# Altium project cpu mais pipoca D.PrjPcb
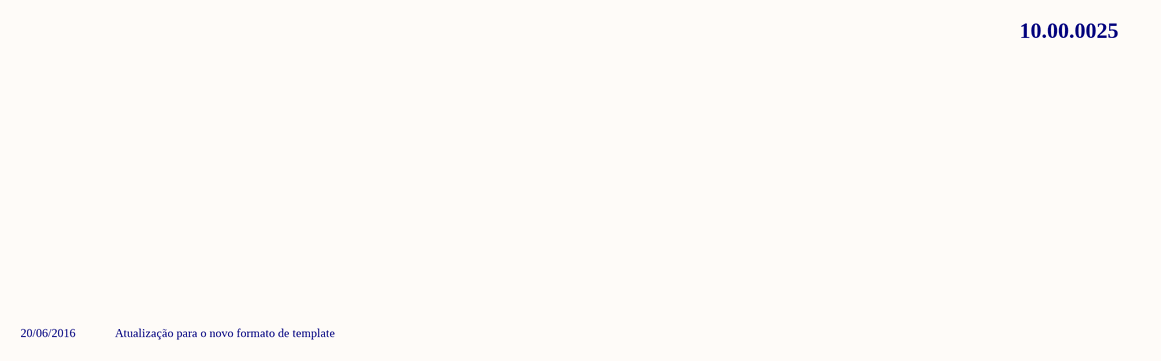
[diagram p0: Capa.SchDoc]
16 sheets, 247 parts. Net scope: global (net labels, ports and power ports of the same name join across sheets).
Board file: PIPOCPUD_2006.PCBDOC
Sheets:
  Capa.SchDoc
  amplificadorAudio.SchDoc
  ControleLeds.SchDoc
  ControlePotencia.SchDoc
  CPU.SchDoc
  EntradaSensores.SchDoc
  EntradaSensorTemperatura.SchDoc
  IHM.SchDoc
  InterfaceConfiguracao.SchDoc
  InterfaceGSM.SchDoc
  InterfacePagamentos.SchDoc
  JTAG.SchDoc
  Memoria.SchDoc
  ModuloCelular.SchDoc
  Regulador.SchDoc
  SaidasMotoresCC.SchDoc

## Sheet Capa.SchDoc: CONTROLADORA MAIS PIPOCA REV. D
size A3; Author: Marcos Aquino; DocumentNumber: 1; SheetNumber: 1; SheetTotal: 16

### Notes on the sheet
- 10.00.0025
- 20/06/2016
- Atualização para o novo formato de template
- Código
- Quark Tecnologia Eletrônica Ltda.
- Rua 216, nº 238 - Sala 01 - Meia Praia - Itapema/SC
- Observações
- (47) 3246-6352  -
- www.quarktee.com.br
- contato@quarktee.com.br
- Projeto
- Quantidade de Páginas
- Revisão
- Projetista
- Local arquivos no servidor
- Data
- Modificação
- Solicitador por:
- Executador por:
- Aprovado por:

## Sheet amplificadorAudio.SchDoc: CONTROLADORA AIRPOPCORN
size A3; DocumentNumber: 10.00.0025; SheetNumber: 2; SheetTotal: 16
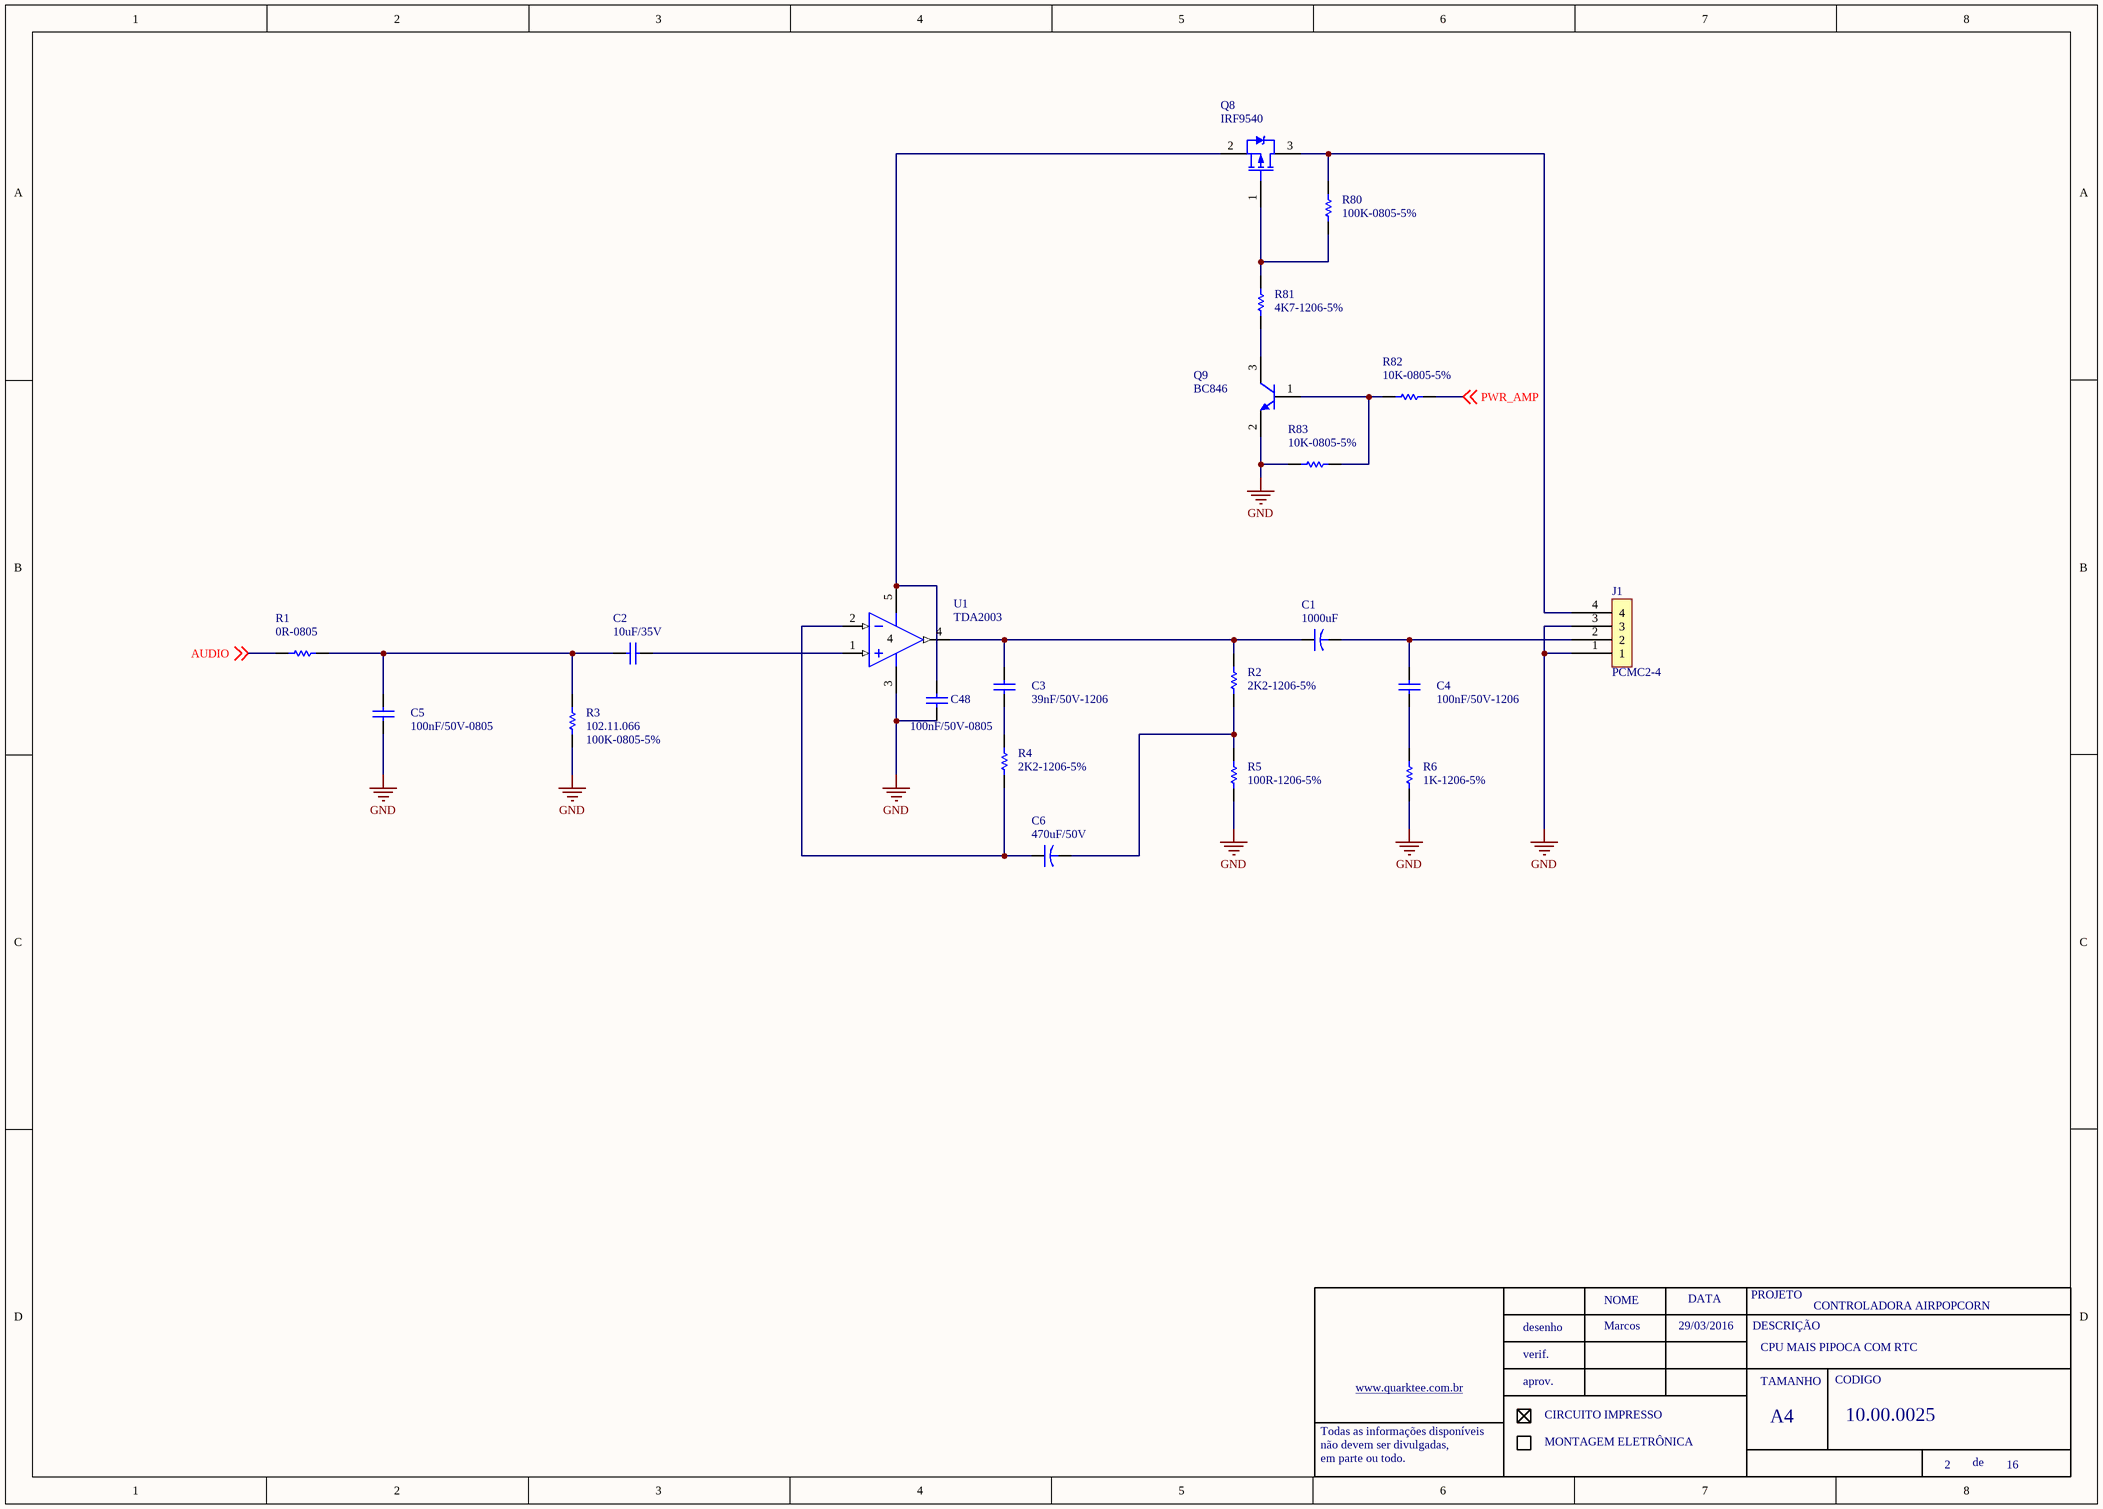
[diagram p1: amplificadorAudio.SchDoc]

### Parts
C1  1000uF  [CAP 10X5]
C2  10uF/35V  [CAP POL 5x11mm]
C3  39nF/50V-1206  [1206-REVISADO O]
C4  100nF/50V-1206  [1206-REVISADO O]
C5  100nF/50V-0805  [0805-REVISADO O]
C6  470uF/50V  [CAP 10X5]
C48  100nF/50V-0805  [0805-REVISADO O]
J1  PCMC2-4  [PCMC2-4]
Q8  IRF9540  [TO220-3 EM PÉ]
Q9  BC846  [SOT23 - REVISAD]
R1  0R-0805  [0805-REVISADO O]
R2  2K2-1206-5%  [1206-REVISADO O]
R3  100K-0805-5%  ERP: 102.11.066  [0805-REVISADO O]
R4  2K2-1206-5%  [1206-REVISADO O]
R5  100R-1206-5%  [1206-REVISADO O]
R6  1K-1206-5%  [1206-REVISADO O]
R80  100K-0805-5%  [0805-REVISADO O]
R81  4K7-1206-5%  [1206-REVISADO O]
R82  10K-0805-5%  [0805-REVISADO O]
R83  10K-0805-5%  [0805-REVISADO O]
U1  TDA2003  [PENTAWATT V]

### Nets
GND: C5.1 C48.1 J1.1 J1.3 Q9.2(E) R3.1 R5.2 R6.2 R83.1 U1.3(GND)
AUDIO: R1.1 ; off-sheet AUDIO
PWR_AMP: R82.2 ; off-sheet PWR_AMP
NetC1_1: C1.1 C3.2 R2.1 U1.4(OUT)
NetC1_2: C1.2 C4.2 J1.2
NetC2_1: C2.1 C5.2 R1.2 R3.2
NetC2_2: C2.2 U1.1(IN+)
NetC3_1: C3.1 R4.1
NetC4_1: C4.1 R6.1
NetC6_1: C6.1 R4.2 U1.2(IN-)
NetC6_2: C6.2 R2.2 R5.1
NetC48_2: C48.2 Q8.2(DRENO) U1.5(V+)
NetJ1_4: J1.4 Q8.3(SOURCE) R80.2
NetQ8_1: Q8.1(GATE) R80.1 R81.2
NetQ9_1: Q9.1(B) R82.1 R83.2
NetQ9_3: Q9.3(C) R81.1

### Notes on the sheet
- Marcos
- 29/03/2016
- CPU MAIS PIPOCA COM RTC
- NOME
- DATA
- PROJETO
- DESCRIÇÃO
- www.quarktee.com.br
- desenho
- verif.
- aprov.
- TAMANHO
- CODIGO
- Todas as informações disponíveis
- não devem ser divulgadas,
- em parte ou todo.
- CIRCUITO IMPRESSO
- MONTAGEM ELETRÔNICA
- A4
- de

### Library data of the parts
C1 = 470uF/50V: ERP: 105.01.005
C2 = 10uF/35V-tantalo-2413
C3-C5 C48 = 100nF/50-0805-NPO: ERP: 104.11.005
Q9 = BC846: BC846L; ERP: 106.22.001
R1 = 1K-0805-5%: ERP: 102.11.042
R2 R4-R6 = 390R-2512-5%: ERP: 102.31.002
R80 = RES 100K-0805: 100K-0805; ERP: 102.11.066
C6 = 470uF/50V: ERP: 105.01.005
R81 = 4K7-1206-5%: ERP: 102.12.050
R82 R83 = 10K-0805-5%: ERP: 102.11.054

## Sheet ControleLeds.SchDoc: CONTROLADORA AIRPOPCORN
size A3; DocumentNumber: 10.00.0025; SheetNumber: 3; SheetTotal: 16
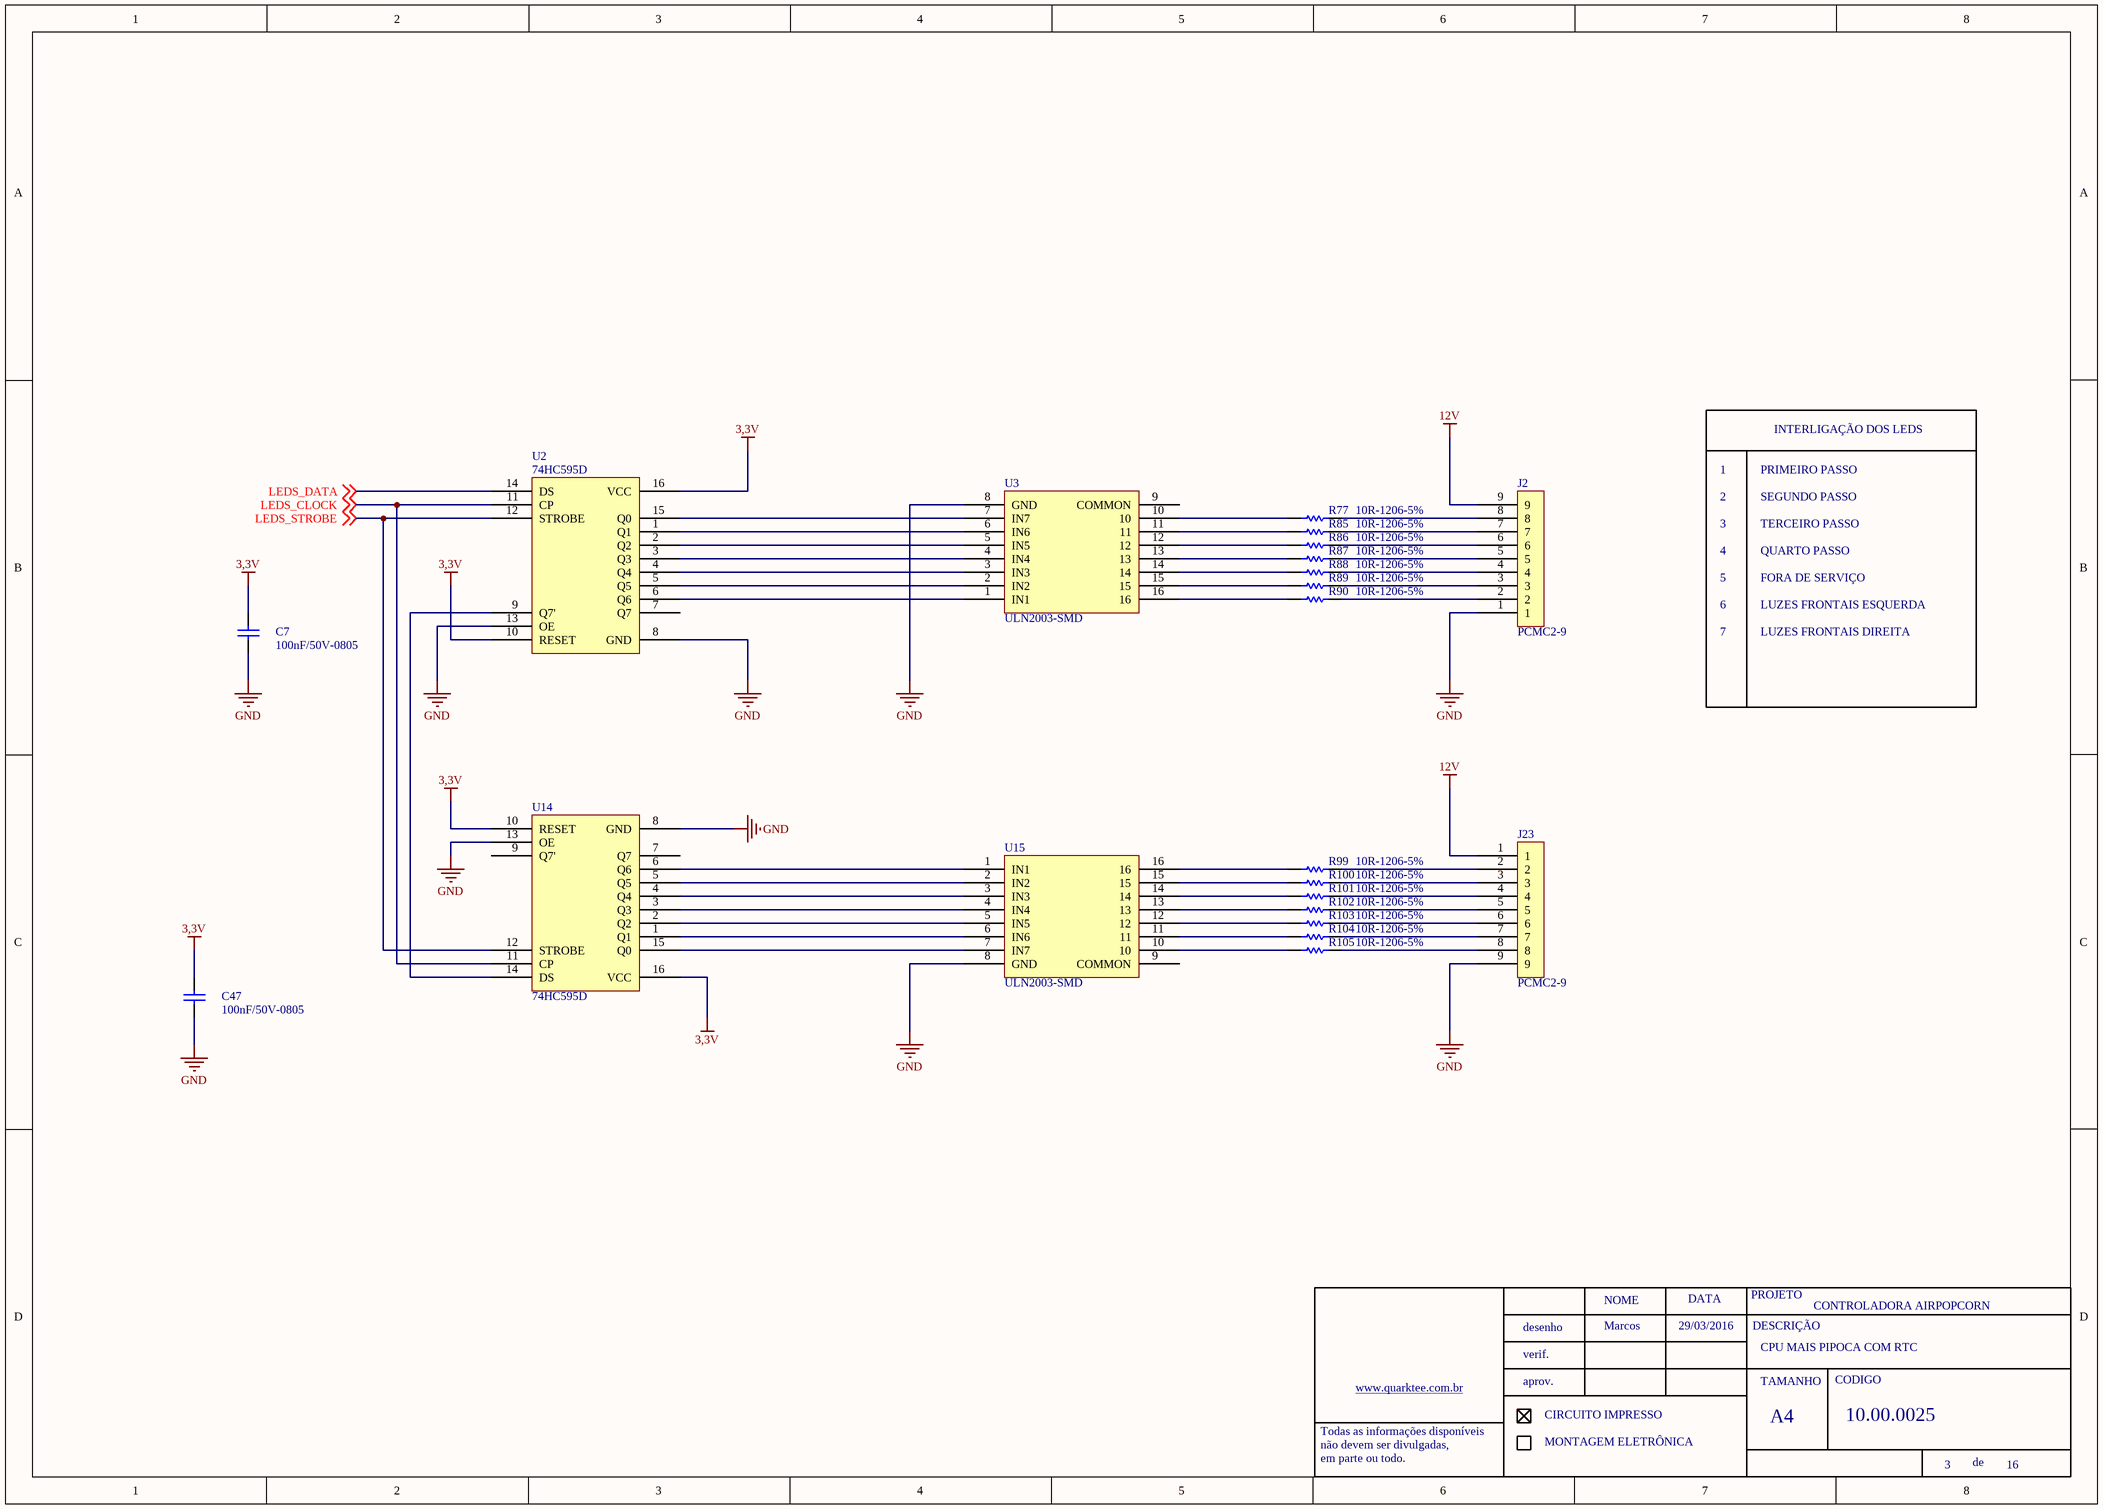
[diagram p2: ControleLeds.SchDoc]

### Parts
C7  100nF/50V-0805  [0805-REVISADO O]
C47  100nF/50V-0805  [0805-REVISADO O]
J2  PCMC2-9  [PCMC2-9]
J23  PCMC2-9  [PCMC2-9]
R77  10R-1206-5%  [1206-REVISADO O]
R85  10R-1206-5%  [1206-REVISADO O]
R86  10R-1206-5%  [1206-REVISADO O]
R87  10R-1206-5%  [1206-REVISADO O]
R88  10R-1206-5%  [1206-REVISADO O]
R89  10R-1206-5%  [1206-REVISADO O]
R90  10R-1206-5%  [1206-REVISADO O]
R99  10R-1206-5%  [1206-REVISADO O]
R100  10R-1206-5%  [1206-REVISADO O]
R101  10R-1206-5%  [1206-REVISADO O]
R102  10R-1206-5%  [1206-REVISADO O]
R103  10R-1206-5%  [1206-REVISADO O]
R104  10R-1206-5%  [1206-REVISADO O]
R105  10R-1206-5%  [1206-REVISADO O]
U2  74HC595D  [SOIC 16 PINOS]
U3  ULN2003-SMD  [SOIC 16 PINOS]
U14  74HC595D  [SOIC 16 PINOS]
U15  ULN2003-SMD  [SOIC 16 PINOS]

### Nets
3,3V: C7.2 C47.2 U2.10(RESET) U2.16(VCC) U14.10(RESET) U14.16(VCC)
12V: J2.9 J23.1
GND: C7.1 C47.1 J2.1 J23.9 U2.8(GND) U2.13(OE) U3.8(GND) U14.8(GND) U14.13(OE) U15.8(GND)
LEDS_CLOCK: U2.11(CP) U14.11(CP) ; off-sheet LEDS_CLOCK
LEDS_DATA: U2.14(DS) ; off-sheet LEDS_DATA
LEDS_STROBE: U2.12(STROBE) U14.12(STROBE) ; off-sheet LEDS_STROBE
NetJ2_2: J2.2 R90.2
NetJ2_3: J2.3 R89.2
NetJ2_4: J2.4 R88.2
NetJ2_5: J2.5 R87.2
NetJ2_6: J2.6 R86.2
NetJ2_7: J2.7 R85.2
NetJ2_8: J2.8 R77.2
NetJ23_2: J23.2 R99.2
NetJ23_3: J23.3 R100.2
NetJ23_4: J23.4 R101.2
NetJ23_5: J23.5 R102.2
NetJ23_6: J23.6 R103.2
NetJ23_7: J23.7 R104.2
NetJ23_8: J23.8 R105.2
NetR77_1: R77.1 U3.10
NetR85_1: R85.1 U3.11
NetR86_1: R86.1 U3.12
NetR87_1: R87.1 U3.13
NetR88_1: R88.1 U3.14
NetR89_1: R89.1 U3.15
NetR90_1: R90.1 U3.16
NetR99_1: R99.1 U15.16
NetR100_1: R100.1 U15.15
NetR101_1: R101.1 U15.14
NetR102_1: R102.1 U15.13
NetR103_1: R103.1 U15.12
NetR104_1: R104.1 U15.11
NetR105_1: R105.1 U15.10
NetU2_1: U2.1(Q1) U3.6(IN6)
NetU2_2: U2.2(Q2) U3.5(IN5)
NetU2_3: U2.3(Q3) U3.4(IN4)
NetU2_4: U2.4(Q4) U3.3(IN3)
NetU2_5: U2.5(Q5) U3.2(IN2)
NetU2_6: U2.6(Q6) U3.1(IN1)
NetU2_9: U2.9(Q7') U14.14(DS)
NetU2_15: U2.15(Q0) U3.7(IN7)
NetU14_1: U14.1(Q1) U15.6(IN6)
NetU14_2: U14.2(Q2) U15.5(IN5)
NetU14_3: U14.3(Q3) U15.4(IN4)
NetU14_4: U14.4(Q4) U15.3(IN3)
NetU14_5: U14.5(Q5) U15.2(IN2)
NetU14_6: U14.6(Q6) U15.1(IN1)
NetU14_15: U14.15(Q0) U15.7(IN7)

Not connected (* = marked no-connect by the designer): U2 7(Q7); U3 9(COMMON); U14 7(Q7) 9(Q7'); U15 9(COMMON)

### Notes on the sheet
- INTERLIGAÇÃO DOS LEDS
- 1
- 2
- PRIMEIRO PASSO
- SEGUNDO PASSO
- 3
- 4
- 5
- TERCEIRO PASSO
- QUARTO PASSO
- FORA DE SERVIÇO
- 6
- 7
- LUZES FRONTAIS ESQUERDA
- LUZES FRONTAIS DIREITA
- Marcos
- 29/03/2016
- CPU MAIS PIPOCA COM RTC
- NOME
- DATA
- PROJETO
- DESCRIÇÃO
- www.quarktee.com.br
- desenho
- verif.
- aprov.
- TAMANHO
- CODIGO
- Todas as informações disponíveis
- não devem ser divulgadas,
- em parte ou todo.
- CIRCUITO IMPRESSO
- MONTAGEM ELETRÔNICA
- A4
- de

### Library data of the parts
C7 C47 = 100nF/50-0805-NPO: ERP: 104.11.005
R77 R85-R90 R99-R105 = 10R-0805-5%
U2 U14 = 74HC595D: ERP: CADASTRAR
U3 U15 = ULN2003

## Sheet ControlePotencia.SchDoc: CONTROLADORA AIRPOPCORN
size A3; DocumentNumber: 10.00.0025; SheetNumber: 4; SheetTotal: 16
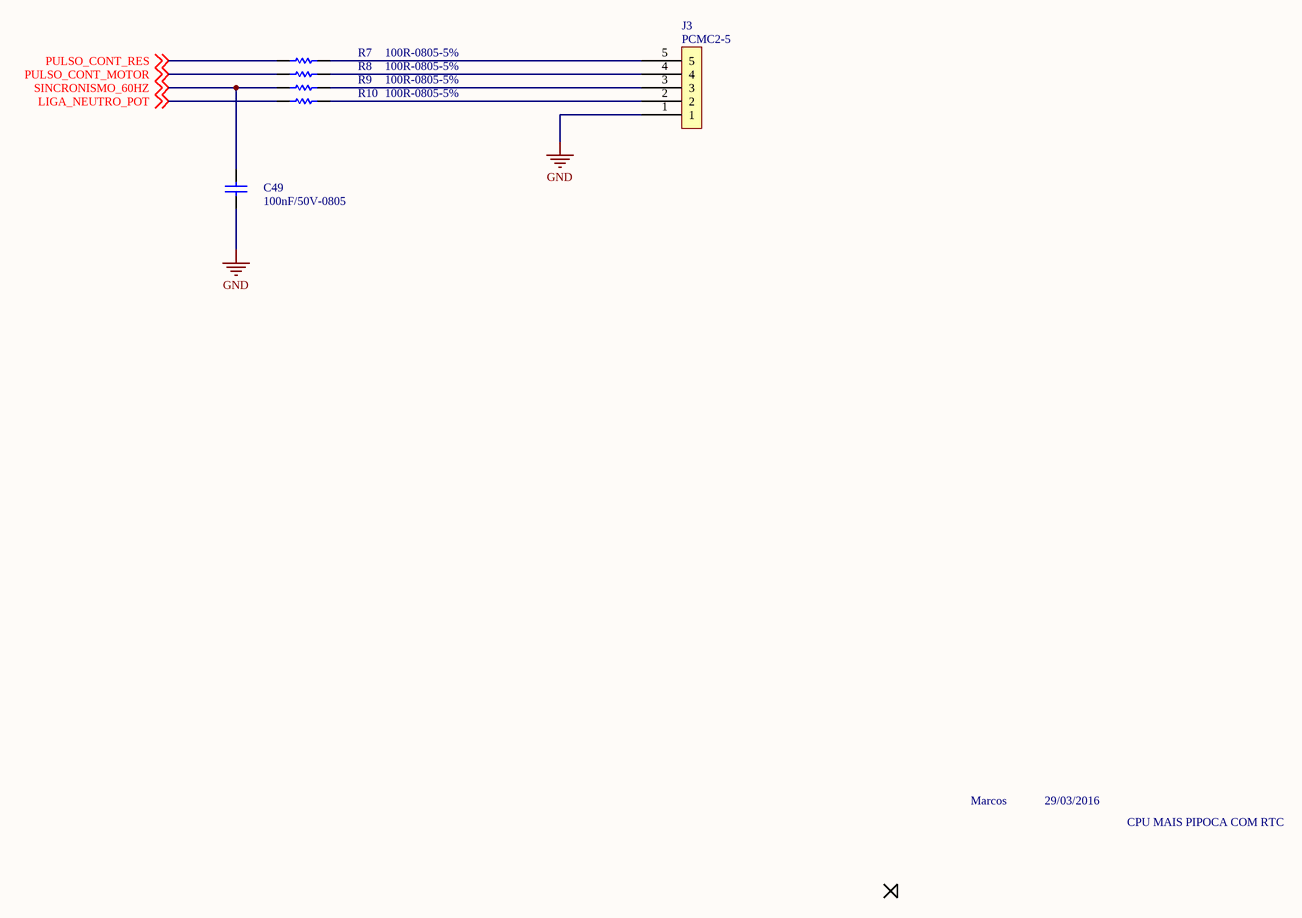
[diagram p3: ControlePotencia.SchDoc]

### Parts
C49  100nF/50V-0805
J3  PCMC2-5  [PCMC2-5]
R7  100R-0805-5%  [0805-REVISADO O]
R8  100R-0805-5%  [0805-REVISADO O]
R9  100R-0805-5%  [0805-REVISADO O]
R10  100R-0805-5%  [0805-REVISADO O]

### Nets
GND: C49.1 J3.1
LIGA_NEUTRO_POT: R10.1 ; off-sheet LIGA_NEUTRO_POT
PULSO_CONT_MOTOR: R8.1 ; off-sheet PULSO_CONT_MOTOR
PULSO_CONT_RES: R7.1 ; off-sheet PULSO_CONT_RES
SINCRONISMO_60HZ: C49.2 R9.1 ; off-sheet SINCRONISMO_60HZ
NetJ3_2: J3.2 R10.2
NetJ3_3: J3.3 R9.2
NetJ3_4: J3.4 R8.2
NetJ3_5: J3.5 R7.2

### Notes on the sheet
- Marcos
- 29/03/2016
- CPU MAIS PIPOCA COM RTC
- NOME
- DATA
- PROJETO
- DESCRIÇÃO
- www.quarktee.com.br
- desenho
- verif.
- aprov.
- TAMANHO
- CODIGO
- Todas as informações disponíveis
- não devem ser divulgadas,
- em parte ou todo.
- CIRCUITO IMPRESSO
- MONTAGEM ELETRÔNICA
- A4
- de

### Library data of the parts
C49 = 100nF/50-0805-NPO: ERP: 104.11.005
R7-R10 = 100R-0805-5%: ERP: 102.11.031

## Sheet CPU.SchDoc: CONTROLADORA AIRPOPCORN
size A3; DocumentNumber: 10.00.0025; SheetNumber: 5; SheetTotal: 16
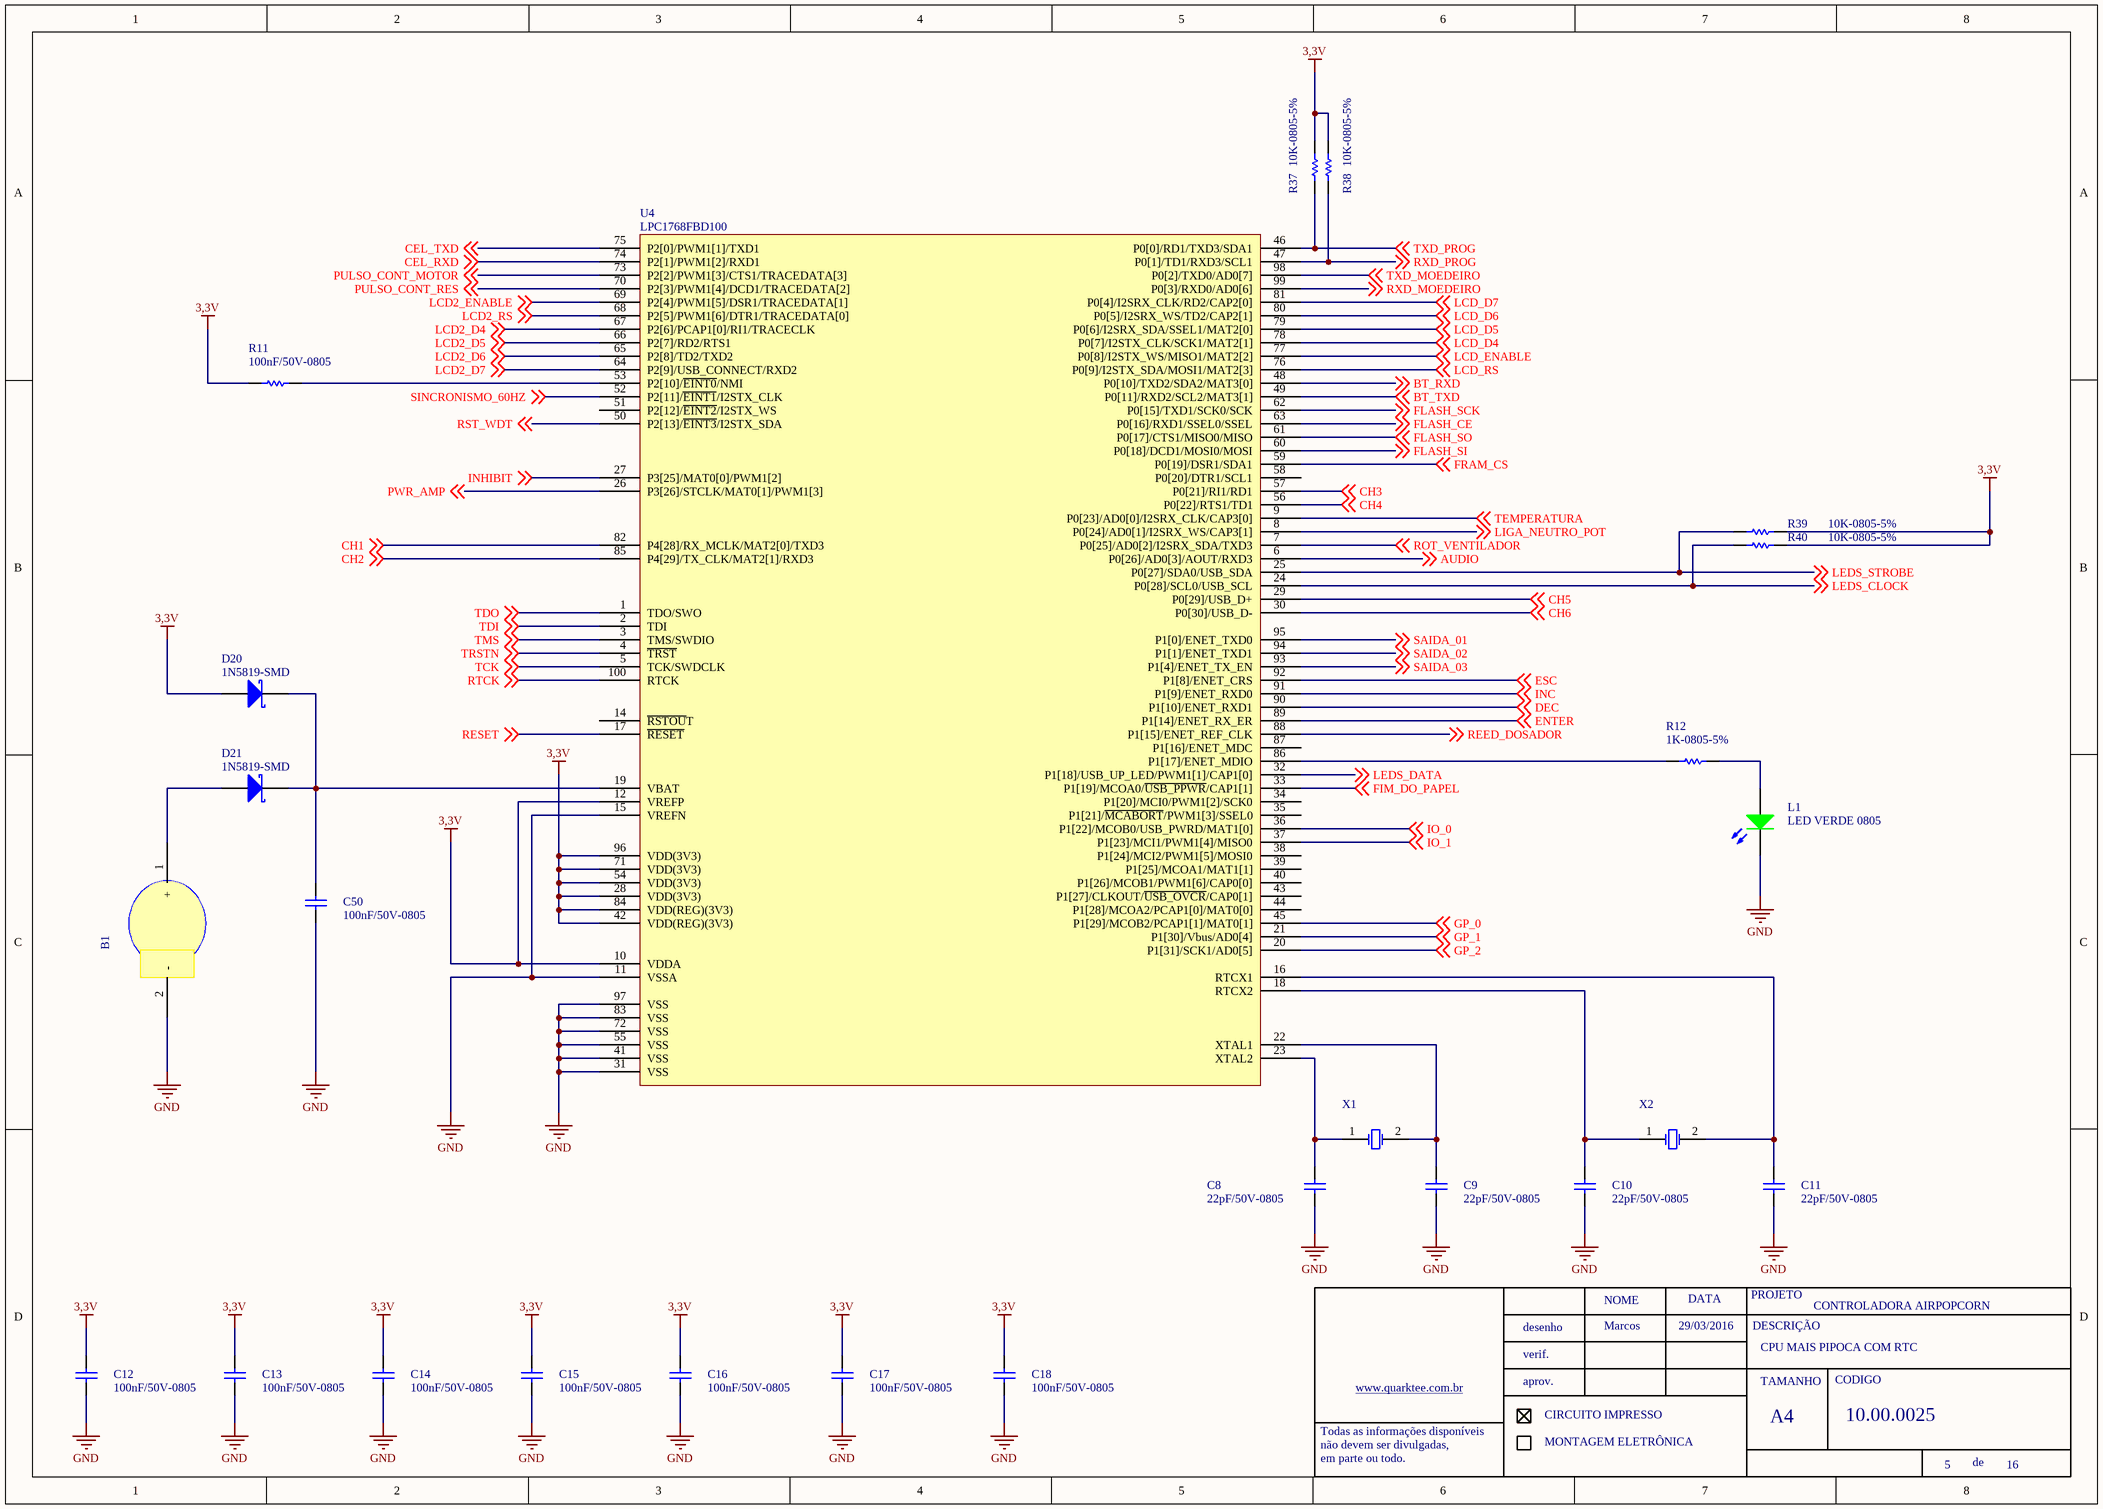
[diagram p4: CPU.SchDoc]

### Parts
B1  (no value)
C8  22pF/50V-0805  [0805-REVISADO O]
C9  22pF/50V-0805  [0805-REVISADO O]
C10  22pF/50V-0805  [0805-REVISADO O]
C11  22pF/50V-0805  [0805-REVISADO O]
C12  100nF/50V-0805  [0805-REVISADO O]
C13  100nF/50V-0805  [0805-REVISADO O]
C14  100nF/50V-0805  [0805-REVISADO O]
C15  100nF/50V-0805  [0805-REVISADO O]
C16  100nF/50V-0805  [0805-REVISADO O]
C17  100nF/50V-0805  [0805-REVISADO O]
C18  100nF/50V-0805  [0805-REVISADO O]
C50  100nF/50V-0805  [0805-REVISADO O]
D20  1N5819-SMD
D21  1N5819-SMD
L1  LED VERDE 0805  [LED 0805 - REVI]
R11  100nF/50V-0805  [0805-REVISADO O]
R12  1K-0805-5%  [0805-REVISADO O]
R37  10K-0805-5%  [0805-REVISADO O]
R38  10K-0805-5%  [0805-REVISADO O]
R39  10K-0805-5%  [0805-REVISADO O]
R40  10K-0805-5%  [0805-REVISADO O]
U4  LPC1768FBD100  [LQFP-100 pasta]
X1  (no value)  [XTALV']
X2  (no value)  [XTAL_32768']

### Nets
3,3V: C12.2 C13.2 C14.2 C15.2 C16.2 C17.2 C18.2 D20.1(A) R11.1 R37.2 R38.2 R39.2 R40.2 U4.10(VDDA) U4.12(VREFP) U4.28(VDD(3V3)) U4.42(VDD(REG)(3V3)) U4.54(VDD(3V3)) U4.71(VDD(3V3)) U4.84(VDD(REG)(3V3)) U4.96(VDD(3V3))
GND: B1.2(-) C8.1 C9.1 C10.1 C11.1 C12.1 C13.1 C14.1 C15.1 C16.1 C17.1 C18.1 C50.1 L1.2(K) U4.11(VSSA) U4.15(VREFN) U4.31(VSS) U4.41(VSS) U4.55(VSS) U4.72(VSS) U4.83(VSS) U4.97(VSS)
AUDIO: U4.6(P0[26]/AD0[3]/AOUT/RXD3) ; off-sheet AUDIO
BT_RXD: U4.48(P0[10]/TXD2/SDA2/MAT3[0]) ; off-sheet BT_RXD
BT_TXD: U4.49(P0[11]/RXD2/SCL2/MAT3[1]) ; off-sheet BT_TXD
CEL_RXD: U4.74(P2[1]/PWM1[2]/RXD1) ; off-sheet CEL_RXD
CEL_TXD: U4.75(P2[0]/PWM1[1]/TXD1) ; off-sheet CEL_TXD
CH1: U4.82(P4[28]/RX_MCLK/MAT2[0]/TXD3) ; off-sheet CH1
CH2: U4.85(P4[29]/TX_CLK/MAT2[1]/RXD3) ; off-sheet CH2
CH3: U4.57(P0[21]/RI1/RD1) ; off-sheet CH3
CH4: U4.56(P0[22]/RTS1/TD1) ; off-sheet CH4
CH5: U4.29(P0[29]/USB_D+) ; off-sheet CH5
CH6: U4.30(P0[30]/USB_D-) ; off-sheet CH6
DEC: U4.90(P1[10]/ENET_RXD1) ; off-sheet DEC
ENTER: U4.89(P1[14]/ENET_RX_ER) ; off-sheet ENTER
ESC: U4.92(P1[8]/ENET_CRS) ; off-sheet ESC
FIM_DO_PAPEL: U4.33(P1[19]/MCOA0/~{USB_PPWR}/CAP1[1]) ; off-sheet FIM_DO_PAPEL
FLASH_CE: U4.63(P0[16]/RXD1/SSEL0/SSEL) ; off-sheet FLASH_CE
FLASH_SCK: U4.62(P0[15]/TXD1/SCK0/SCK) ; off-sheet FLASH_SCK
FLASH_SI: U4.60(P0[18]/DCD1/MOSI0/MOSI) ; off-sheet FLASH_SI
FLASH_SO: U4.61(P0[17]/CTS1/MISO0/MISO) ; off-sheet FLASH_SO
FRAM_CS: U4.59(P0[19]/DSR1/SDA1) ; off-sheet FRAM_CS
GP_0: U4.45(P1[29]/MCOB2/PCAP1[1]/MAT0[1]) ; off-sheet GP_0
GP_1: U4.21(P1[30]/Vbus/AD0[4]) ; off-sheet GP_1
GP_2: U4.20(P1[31]/SCK1/AD0[5]) ; off-sheet GP_2
INC: U4.91(P1[9]/ENET_RXD0) ; off-sheet INC
INHIBIT: U4.27(P3[25]/MAT0[0]/PWM1[2]) ; off-sheet INHIBIT
IO_0: U4.36(P1[22]/MCOB0/USB_PWRD/MAT1[0]) ; off-sheet IO_0
IO_1: U4.37(P1[23]/MCI1/PWM1[4]/MISO0) ; off-sheet IO_1
LCD2_D4: U4.67(P2[6]/PCAP1[0]/RI1/TRACECLK) ; off-sheet LCD2_D4
LCD2_D5: U4.66(P2[7]/RD2/RTS1) ; off-sheet LCD2_D5
LCD2_D6: U4.65(P2[8]/TD2/TXD2) ; off-sheet LCD2_D6
LCD2_D7: U4.64(P2[9]/USB_CONNECT/RXD2) ; off-sheet LCD2_D7
LCD2_ENABLE: U4.69(P2[4]/PWM1[5]/DSR1/TRACEDATA[1]) ; off-sheet LCD2_ENABLE
LCD2_RS: U4.68(P2[5]/PWM1[6]/DTR1/TRACEDATA[0]) ; off-sheet LCD2_RS
LCD_D4: U4.78(P0[7]/I2STX_CLK/SCK1/MAT2[1]) ; off-sheet LCD_D4
LCD_D5: U4.79(P0[6]/I2SRX_SDA/SSEL1/MAT2[0]) ; off-sheet LCD_D5
LCD_D6: U4.80(P0[5]/I2SRX_WS/TD2/CAP2[1]) ; off-sheet LCD_D6
LCD_D7: U4.81(P0[4]/I2SRX_CLK/RD2/CAP2[0]) ; off-sheet LCD_D7
LCD_ENABLE: U4.77(P0[8]/I2STX_WS/MISO1/MAT2[2]) ; off-sheet LCD_ENABLE
LCD_RS: U4.76(P0[9]/I2STX_SDA/MOSI1/MAT2[3]) ; off-sheet LCD_RS
LEDS_CLOCK: R40.1 U4.24(P0[28]/SCL0/USB_SCL) ; off-sheet LEDS_CLOCK
LEDS_DATA: U4.32(P1[18]/USB_UP_LED/PWM1[1]/CAP1[0]) ; off-sheet LEDS_DATA
LEDS_STROBE: R39.1 U4.25(P0[27]/SDA0/USB_SDA) ; off-sheet LEDS_STROBE
LIGA_NEUTRO_POT: U4.8(P0[24]/AD0[1]/I2SRX_WS/CAP3[1]) ; off-sheet LIGA_NEUTRO_POT
PULSO_CONT_MOTOR: U4.73(P2[2]/PWM1[3]/CTS1/TRACEDATA[3]) ; off-sheet PULSO_CONT_MOTOR
PULSO_CONT_RES: U4.70(P2[3]/PWM1[4]/DCD1/TRACEDATA[2]) ; off-sheet PULSO_CONT_RES
PWR_AMP: U4.26(P3[26]/STCLK/MAT0[1]/PWM1[3]) ; off-sheet PWR_AMP
REED_DOSADOR: U4.88(P1[15]/ENET_REF_CLK) ; off-sheet REED_DOSADOR
RESET: U4.17(~{RESET}) ; off-sheet RESET
ROT_VENTILADOR: U4.7(P0[25]/AD0[2]/I2SRX_SDA/TXD3) ; off-sheet ROT_VENTILADOR
RST_WDT: U4.50(P2[13]/~{EINT3}/I2STX_SDA) ; off-sheet RST_WDT
RTCK: U4.100(RTCK) ; off-sheet RTCK
RXD_MOEDEIRO: U4.99(P0[3]/RXD0/AD0[6]) ; off-sheet RXD_MOEDEIRO
RXD_PROG: R38.1 U4.47(P0[1]/TD1/RXD3/SCL1) ; off-sheet RXD_PROG
SAIDA_01: U4.95(P1[0]/ENET_TXD0) ; off-sheet SAIDA_01
SAIDA_02: U4.94(P1[1]/ENET_TXD1) ; off-sheet SAIDA_02
SAIDA_03: U4.93(P1[4]/ENET_TX_EN) ; off-sheet SAIDA_03
SINCRONISMO_60HZ: U4.52(P2[11]/~{EINT1}/I2STX_CLK) ; off-sheet SINCRONISMO_60HZ
TCK: U4.5(TCK/SWDCLK) ; off-sheet TCK
TDI: U4.2(TDI) ; off-sheet TDI
TDO: U4.1(TDO/SWO) ; off-sheet TDO
TEMPERATURA: U4.9(P0[23]/AD0[0]/I2SRX_CLK/CAP3[0]) ; off-sheet TEMPERATURA
TMS: U4.3(TMS/SWDIO) ; off-sheet TMS
TRSTN: U4.4(~{TRST}) ; off-sheet TRSTN
TXD_MOEDEIRO: U4.98(P0[2]/TXD0/AD0[7]) ; off-sheet TXD_MOEDEIRO
TXD_PROG: R37.1 U4.46(P0[0]/RD1/TXD3/SDA1) ; off-sheet TXD_PROG
NetB1_1: B1.1(+) D21.1(A)
NetC8_2: C8.2 U4.23(XTAL2) X1.1(OSC1)
NetC9_2: C9.2 U4.22(XTAL1) X1.2(OSC2)
NetC10_2: C10.2 U4.18(RTCX2) X2.1(OSC1)
NetC11_2: C11.2 U4.16(RTCX1) X2.2(OSC2)
NetC50_2: C50.2 D20.2(K) D21.2(K) U4.19(VBAT)
NetL1_1: L1.1(A) R12.2
NetR11_2: R11.2 U4.53(P2[10]/~{EINT0}/NMI)
NetR12_1: R12.1 U4.86(P1[17]/ENET_MDIO)

Not connected (* = marked no-connect by the designer): U4 14(~{RSTOU}T) 34(P1[20]/MCI0/PWM1[2]/SCK0) 35(P1[21]/~{MCABORT}/PWM1[3]/SSEL0) 38(P1[24]/MCI2/PWM1[5]/MOSI0) 39(P1[25]/MCOA1/MAT1[1]) 40(P1[26]/MCOB1/PWM1[6]/CAP0[0]) 43(P1[27]/CLKOUT/~{USB_OVCR}/CAP0[1]) 44(P1[28]/MCOA2/PCAP1[0]/MAT0[0]) 51(P2[12]/~{EINT2}/I2STX_WS) 58(P0[20]/DTR1/SCL1) 87(P1[16]/ENET_MDC)

### Notes on the sheet
- Marcos
- 29/03/2016
- CPU MAIS PIPOCA COM RTC
- NOME
- DATA
- PROJETO
- DESCRIÇÃO
- www.quarktee.com.br
- desenho
- verif.
- aprov.
- TAMANHO
- CODIGO
- Todas as informações disponíveis
- não devem ser divulgadas,
- em parte ou todo.
- CIRCUITO IMPRESSO
- MONTAGEM ELETRÔNICA
- A4
- de

### Library data of the parts
B1 = SUPORTE PILHA CR2032: ERP: 437.00.100
C8-C11 = 22pF-0805-NPO: ERP: 104.11.001
C12-C18 C50 = 100nF/50-0805-NPO: ERP: 104.11.005
D20 D21 = 1N5819: ERP: 121.20.002
L1 = LED VERDE 0603 SMD: LED VERDE 0603 VERDE; ERP: 124.02.011
R11 = 10K-0805-5%: ERP: 102.11.054
U4 = LPC1768FDB100: ERP: 110.02.004
X1 = CRISTAL 12MHZ: 12MHZ; ERP: 134.01.003
X2 = CRISTAL 32.768 Hz: CRISTAL 32.768Hz; ERP: 134.01.002
R12 = 1K-0805-5%: ERP: 102.11.042
R37-R40 = 10K-0805-5%: ERP: 102.11.054

## Sheet EntradaSensores.SchDoc: CONTROLADORA AIRPOPCORN
size A3; DocumentNumber: 10.00.0025; SheetNumber: 6; SheetTotal: 16
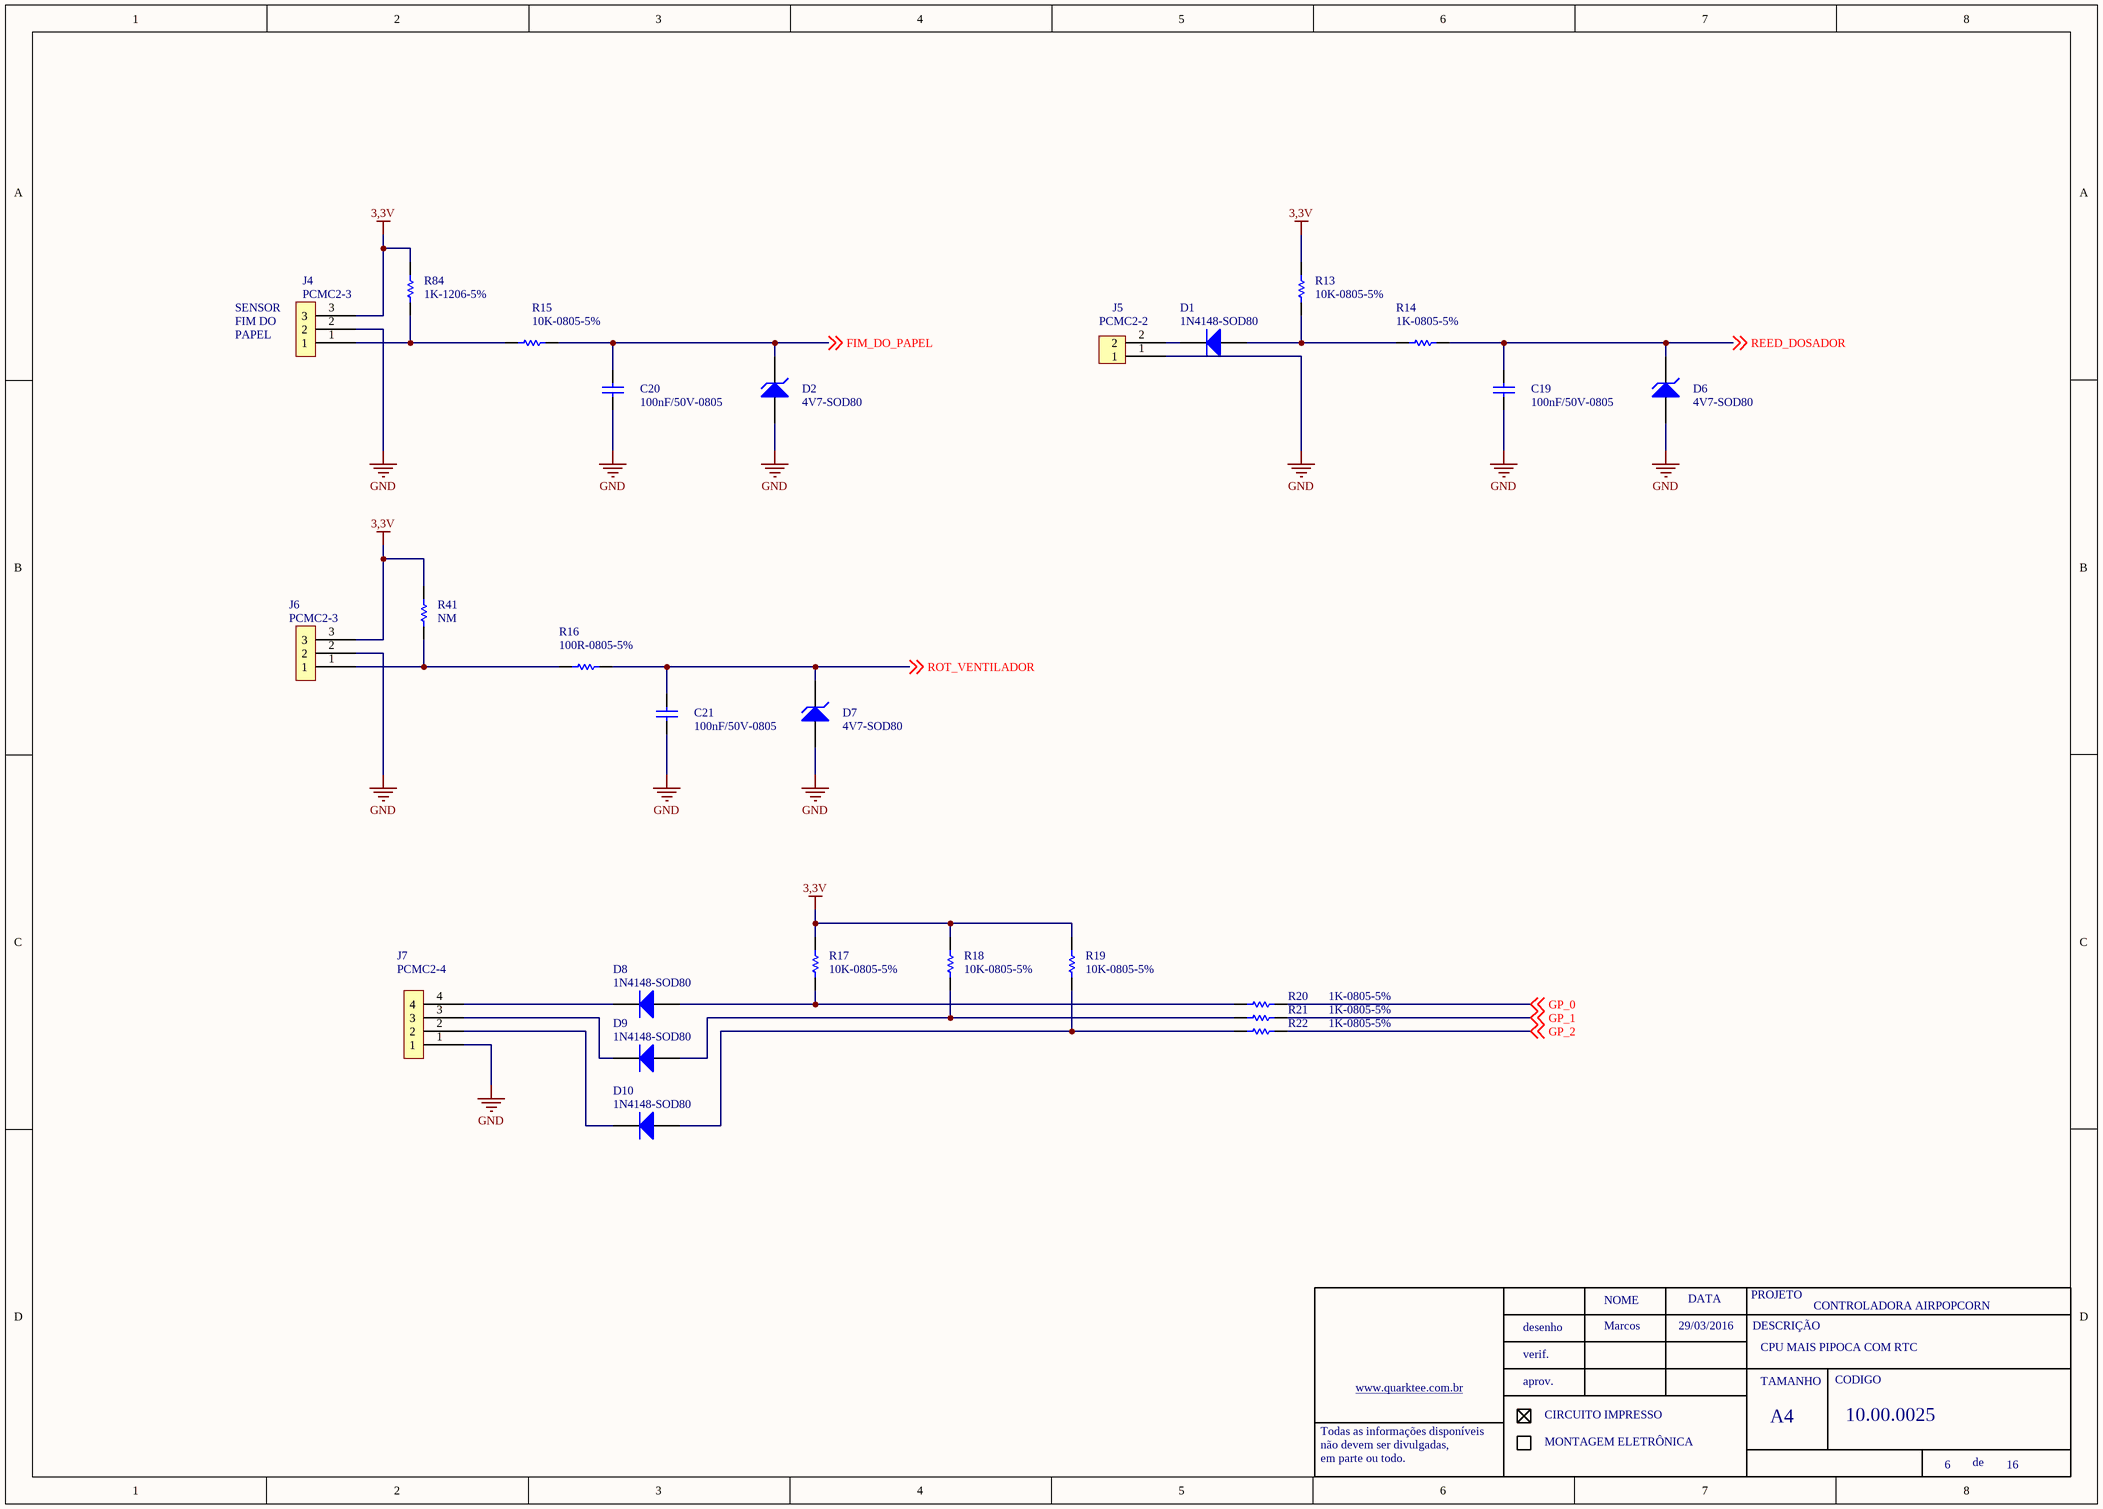
[diagram p5: EntradaSensores.SchDoc]

### Parts
C19  100nF/50V-0805  [0805-REVISADO O]
C20  100nF/50V-0805  [0805-REVISADO O]
C21  100nF/50V-0805  [0805-REVISADO O]
D1  1N4148-SOD80  [MINIMLEF/SOD80]
D2  4V7-SOD80  [MINIMLEF/SOD80]
D6  4V7-SOD80  [MINIMLEF/SOD80]
D7  4V7-SOD80  [MINIMLEF/SOD80]
D8  1N4148-SOD80  [MINIMLEF/SOD80]
D9  1N4148-SOD80  [MINIMLEF/SOD80]
D10  1N4148-SOD80  [MINIMLEF/SOD80]
J4  PCMC2-3  [PCMC2-3]
J5  PCMC2-2  [PCMC2-2]
J6  PCMC2-3  [PCMC2-3]
J7  PCMC2-4  [PCMC2-4]
R13  10K-0805-5%  [0805-REVISADO O]
R14  1K-0805-5%  [0805-REVISADO O]
R15  10K-0805-5%  [0805-REVISADO O]
R16  100R-0805-5%  [0805-REVISADO O]
R17  10K-0805-5%  [0805-REVISADO O]
R18  10K-0805-5%  [0805-REVISADO O]
R19  10K-0805-5%  [0805-REVISADO O]
R20  1K-0805-5%  [0805-REVISADO O]
R21  1K-0805-5%  [0805-REVISADO O]
R22  1K-0805-5%  [0805-REVISADO O]
R41  NM  [0805-REVISADO O]
R84  1K-1206-5%  [1206-REVISADO O]

### Nets
3,3V: J4.3 J6.3 R13.2 R17.2 R18.2 R19.2 R41.2 R84.2
GND: C19.1 C20.1 C21.1 D2.1(A) D6.1(A) D7.1(A) J4.2 J5.1 J6.2 J7.1
FIM_DO_PAPEL: C20.2 D2.2(K) R15.2 ; off-sheet FIM_DO_PAPEL
GP_0: R20.2 ; off-sheet GP_0
GP_1: R21.2 ; off-sheet GP_1
GP_2: R22.2 ; off-sheet GP_2
REED_DOSADOR: C19.2 D6.2(K) R14.2 ; off-sheet REED_DOSADOR
ROT_VENTILADOR: C21.2 D7.2(K) R16.2 ; off-sheet ROT_VENTILADOR
NetD1_1: D1.1 R13.1 R14.1
NetD1_2: D1.2 J5.2
NetD8_1: D8.1 R17.1 R20.1
NetD8_2: D8.2 J7.4
NetD9_1: D9.1 R18.1 R21.1
NetD9_2: D9.2 J7.3
NetD10_1: D10.1 R19.1 R22.1
NetD10_2: D10.2 J7.2
NetJ4_1: J4.1 R15.1 R84.1
NetJ6_1: J6.1 R16.1 R41.1

### Notes on the sheet
- (near J4) SENSOR
- (near J4) FIM DO
- (near J4) PAPEL
- Marcos
- 29/03/2016
- CPU MAIS PIPOCA COM RTC
- NOME
- DATA
- PROJETO
- DESCRIÇÃO
- www.quarktee.com.br
- desenho
- verif.
- aprov.
- TAMANHO
- CODIGO
- Todas as informações disponíveis
- não devem ser divulgadas,
- em parte ou todo.
- CIRCUITO IMPRESSO
- MONTAGEM ELETRÔNICA
- A4
- de

### Library data of the parts
C19 C20 = 100nF/50-0805-NPO: ERP: 104.11.005
C21 = 10nF/50V-0805-NPO: ERP: 104.11.004
D2 D6 D7 = ZENER 3V3-SOD80: 3V3-SOD80-1/2W; ERP: 120.19.005
R15 R16 R41 = 100K-0805-5%: ERP: 102.11.066
R20-R22 = 10K-0805-5%: ERP: 102.11.054
R84 = 1K-0805-5%: ERP: 102.11.042
D1 D8-D10 = 1N4148-SOD80: ERP: 120.19.001
R13 R17-R19 = 10K-0805-5%: ERP: 102.11.054
R14 = 1K-0805-5%: ERP: 102.11.042

## Sheet EntradaSensorTemperatura.SchDoc: CONTROLADORA AIRPOPCORN
size A3; DocumentNumber: 10.00.0025; SheetNumber: 7; SheetTotal: 16
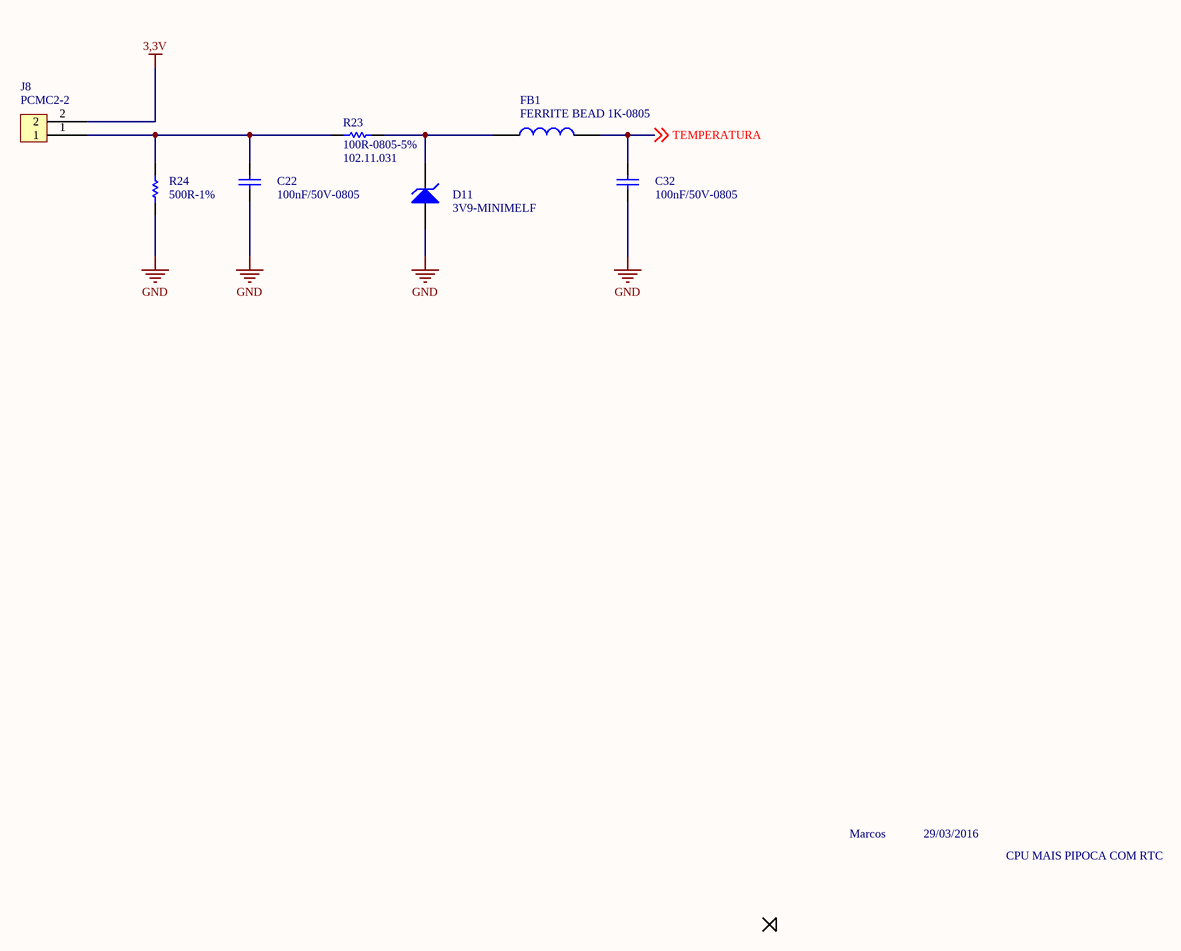
[diagram p6: EntradaSensorTemperatura.SchDoc]

### Parts
C22  100nF/50V-0805  [0805-REVISADO O]
C32  100nF/50V-0805  [0805-REVISADO O]
D11  3V9-MINIMELF  [MINIMLEF/SOD80]
FB1  FERRITE BEAD 1K-0805  [0805-REVISADO O]
J8  PCMC2-2  [PCMC2-2]
R23  100R-0805-5%  ERP: 102.11.031  [0805-REVISADO O]
R24  500R-1%  [0805-REVISADO O]

### Nets
3,3V: J8.2
GND: C22.1 C32.1 D11.1(A) R24.1
TEMPERATURA: C32.2 FB1.2 ; off-sheet TEMPERATURA
NetC22_2: C22.2 J8.1 R23.1 R24.2
NetD11_2: D11.2(K) FB1.1 R23.2

### Notes on the sheet
- Marcos
- 29/03/2016
- CPU MAIS PIPOCA COM RTC
- NOME
- DATA
- PROJETO
- DESCRIÇÃO
- www.quarktee.com.br
- desenho
- verif.
- aprov.
- TAMANHO
- CODIGO
- Todas as informações disponíveis
- não devem ser divulgadas,
- em parte ou todo.
- CIRCUITO IMPRESSO
- MONTAGEM ELETRÔNICA
- A4
- de

### Library data of the parts
C22 C32 = 100nF/50-0805-NPO: ERP: 104.11.005
D11 = ZENER 3V3-SOD80: 3V3-SOD80-1/2W; ERP: 120.19.005
R24 = 10K-0805-5%: ERP: 102.11.054
FB1 = FERRITE BEAD 1K-0805: ERP: 123.02.001

## Sheet IHM.SchDoc: CONTROLADORA AIRPOPCORN
size A3; DocumentNumber: 8; SheetNumber: 10.00.0025; SheetTotal: 16
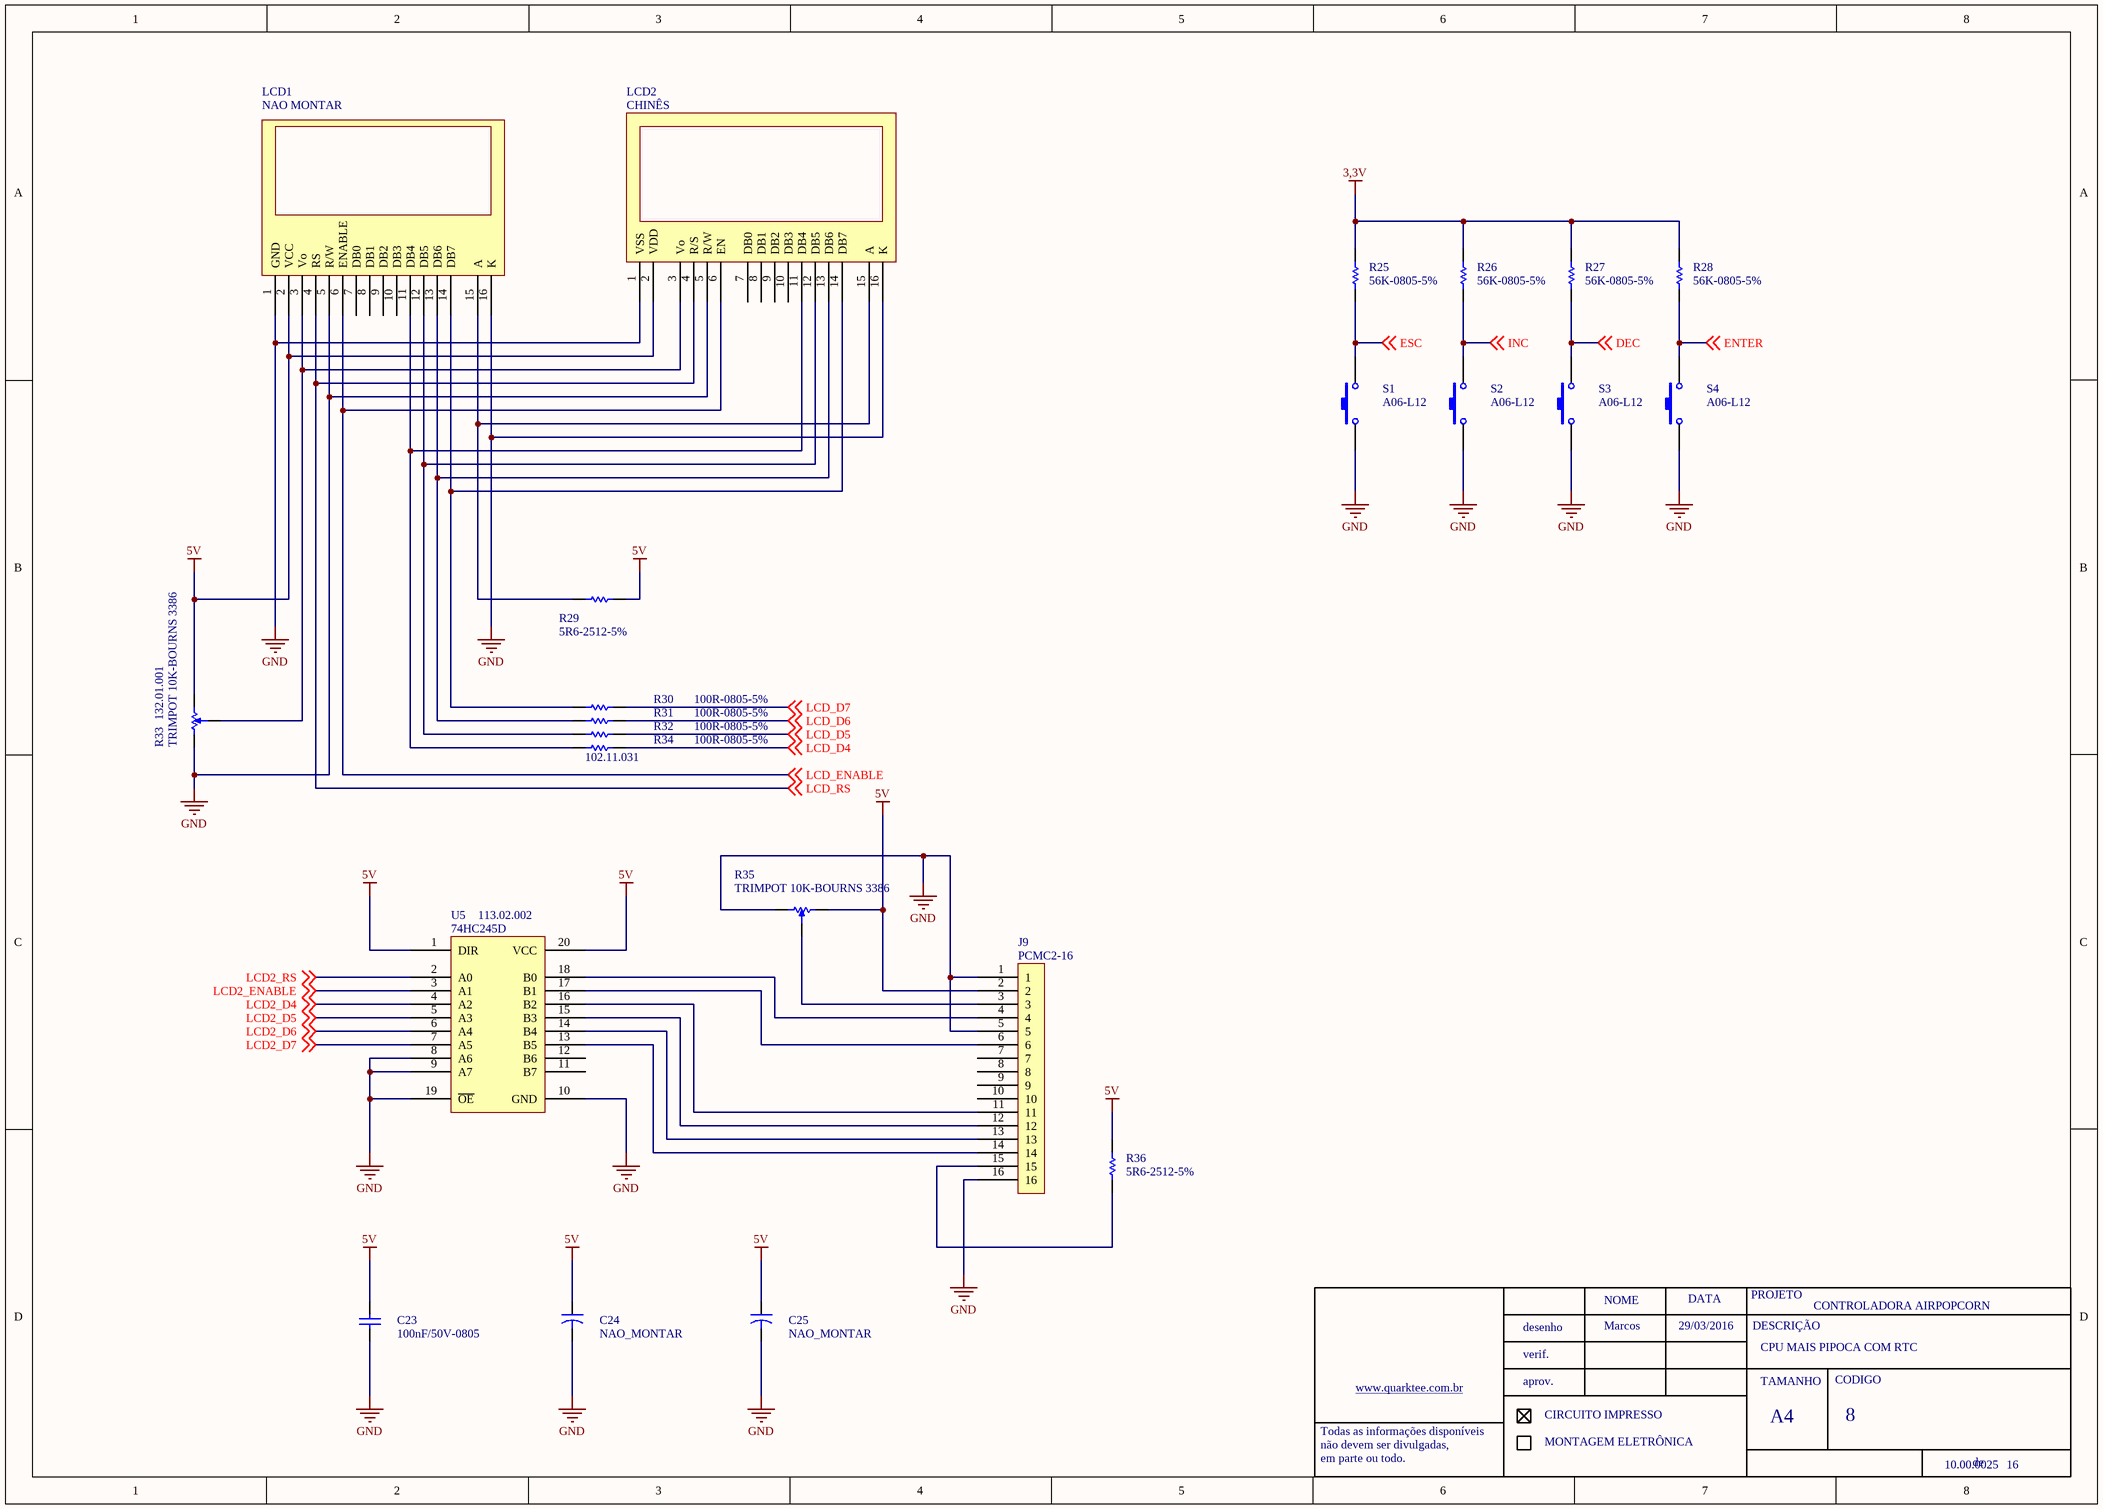
[diagram p7: IHM.SchDoc]

### Parts
C23  100nF/50V-0805  [0805-REVISADO O]
C24  NAO_MONTAR  [CAP 2413 POLARI]
C25  NAO_MONTAR  [CAP 2413 POLARI]
J9  PCMC2-16  [PCMC2-16]
LCD1  NAO MONTAR  [WH1602_WH1602(Primary)]
LCD2  CHINÊS  [LCD CHINES_LCD_CHINES(Primary)]
R25  56K-0805-5%  [0805-REVISADO O]
R26  56K-0805-5%  [0805-REVISADO O]
R27  56K-0805-5%  [0805-REVISADO O]
R28  56K-0805-5%  [0805-REVISADO O]
R29  5R6-2512-5%  [2512 - REVISADO]
R30  100R-0805-5%  [0805-REVISADO O]
R31  100R-0805-5%  [0805-REVISADO O]
R32  100R-0805-5%  ERP: 102.11.031  [0805-REVISADO O]
R33  TRIMPOT 10K-BOURNS 3386  ERP: 132.01.001  [TRIMPOT 3386]
R34  100R-0805-5%  [0805-REVISADO O]
R35  TRIMPOT 10K-BOURNS 3386  [TRIMPOT 3386]
R36  5R6-2512-5%  [2512 - REVISADO]
S1  A06-L12  [CHAVE TACTIL NO_[125](Primary)]
S2  A06-L12  [CHAVE TACTIL NO_[125](Primary)]
S3  A06-L12  [CHAVE TACTIL NO_[125](Primary)]
S4  A06-L12  [CHAVE TACTIL NO_[125](Primary)]
U5  74HC245D  ERP: 113.02.002  [SOIC 20 FEITO A]

### Nets
3,3V: R25.1 R26.1 R27.1 R28.1
5V: C23.2 C24.1 C25.1 J9.2 LCD1.2(VCC) LCD2.2(VDD) R29.1 R33.1 R35.1 R36.2 U5.1(DIR) U5.20(VCC)
GND: C23.1 C24.2 C25.2 J9.1 J9.5 J9.16 LCD1.1(GND) LCD1.5(R/W) LCD1.16(K) LCD2.1(VSS) LCD2.5(R/W) LCD2.16(K) R33.3 R35.3 S1.1 S2.1 S3.1 S4.1 U5.8(A6) U5.9(A7) U5.10(GND) U5.19(~{OE})
DEC: R27.2 S3.2 ; off-sheet DEC
ENTER: R28.2 S4.2 ; off-sheet ENTER
ESC: R25.2 S1.2 ; off-sheet ESC
INC: R26.2 S2.2 ; off-sheet INC
LCD2_D4: U5.4(A2) ; off-sheet LCD2_D4
LCD2_D5: U5.5(A3) ; off-sheet LCD2_D5
LCD2_D6: U5.6(A4) ; off-sheet LCD2_D6
LCD2_D7: U5.7(A5) ; off-sheet LCD2_D7
LCD2_ENABLE: U5.3(A1) ; off-sheet LCD2_ENABLE
LCD2_RS: U5.2(A0) ; off-sheet LCD2_RS
LCD_D4: R34.2 ; off-sheet LCD_D4
LCD_D5: R32.2 ; off-sheet LCD_D5
LCD_D6: R31.2 ; off-sheet LCD_D6
LCD_D7: R30.2 ; off-sheet LCD_D7
LCD_ENABLE: LCD1.6(ENABLE) LCD2.6(EN) ; off-sheet LCD_ENABLE
LCD_RS: LCD1.4(RS) LCD2.4(R/S) ; off-sheet LCD_RS
NetJ9_3: J9.3 R35.2
NetJ9_4: J9.4 U5.18(B0)
NetJ9_6: J9.6 U5.17(B1)
NetJ9_11: J9.11 U5.16(B2)
NetJ9_12: J9.12 U5.15(B3)
NetJ9_13: J9.13 U5.14(B4)
NetJ9_14: J9.14 U5.13(B5)
NetJ9_15: J9.15 R36.1
NetLCD1_3: LCD1.3(Vo) LCD2.3(Vo) R33.2
NetLCD1_11: LCD1.11(DB4) LCD2.11(DB4) R34.1
NetLCD1_12: LCD1.12(DB5) LCD2.12(DB5) R32.1
NetLCD1_13: LCD1.13(DB6) LCD2.13(DB6) R31.1
NetLCD1_14: LCD1.14(DB7) LCD2.14(DB7) R30.1
NetLCD1_15: LCD1.15(A) LCD2.15(A) R29.2

Not connected (* = marked no-connect by the designer): J9 7 8 9 10; LCD1 7(DB0) 8(DB1) 9(DB2) 10(DB3); LCD2 7(DB0) 8(DB1) 9(DB2) 10(DB3); U5 11(B7) 12(B6)

### Notes on the sheet
- Marcos
- 29/03/2016
- CPU MAIS PIPOCA COM RTC
- NOME
- DATA
- PROJETO
- DESCRIÇÃO
- www.quarktee.com.br
- desenho
- verif.
- aprov.
- TAMANHO
- CODIGO
- Todas as informações disponíveis
- não devem ser divulgadas,
- em parte ou todo.
- CIRCUITO IMPRESSO
- MONTAGEM ELETRÔNICA
- A4
- de

### Library data of the parts
C23 = 100nF/50-0805-NPO: ERP: 104.11.005
C24 C25 = 10uF/35V-tantalo: ERP: 104.11.011
LCD1 = WH1602A: ERP: 131.00.001
LCD2 = WH2002: ERP: 131.00.003
R29 R36 = RES 5R6-CR100: 5R6-CR100; ERP: 103.05.016
R33 = TRIMPOT 3386 50K
R35 = TRIMPOT 10K-3386: TRIMPOT 100K-0805-5%; ERP: 132.01.001
R25-R28 = 56K-0805-5%: ERP: 102.11.063
R30-R32 R34 = 100R-0805-5%
  R30 R31 R34: ERP: 102.11.031
S1-S4 = A06-L12: ERP: 136.00.001

## Sheet InterfaceConfiguracao.SchDoc: CONTROLADORA AIRPOPCORN
size A3; DocumentNumber: 10.00.0025; SheetNumber: 9; SheetTotal: 16
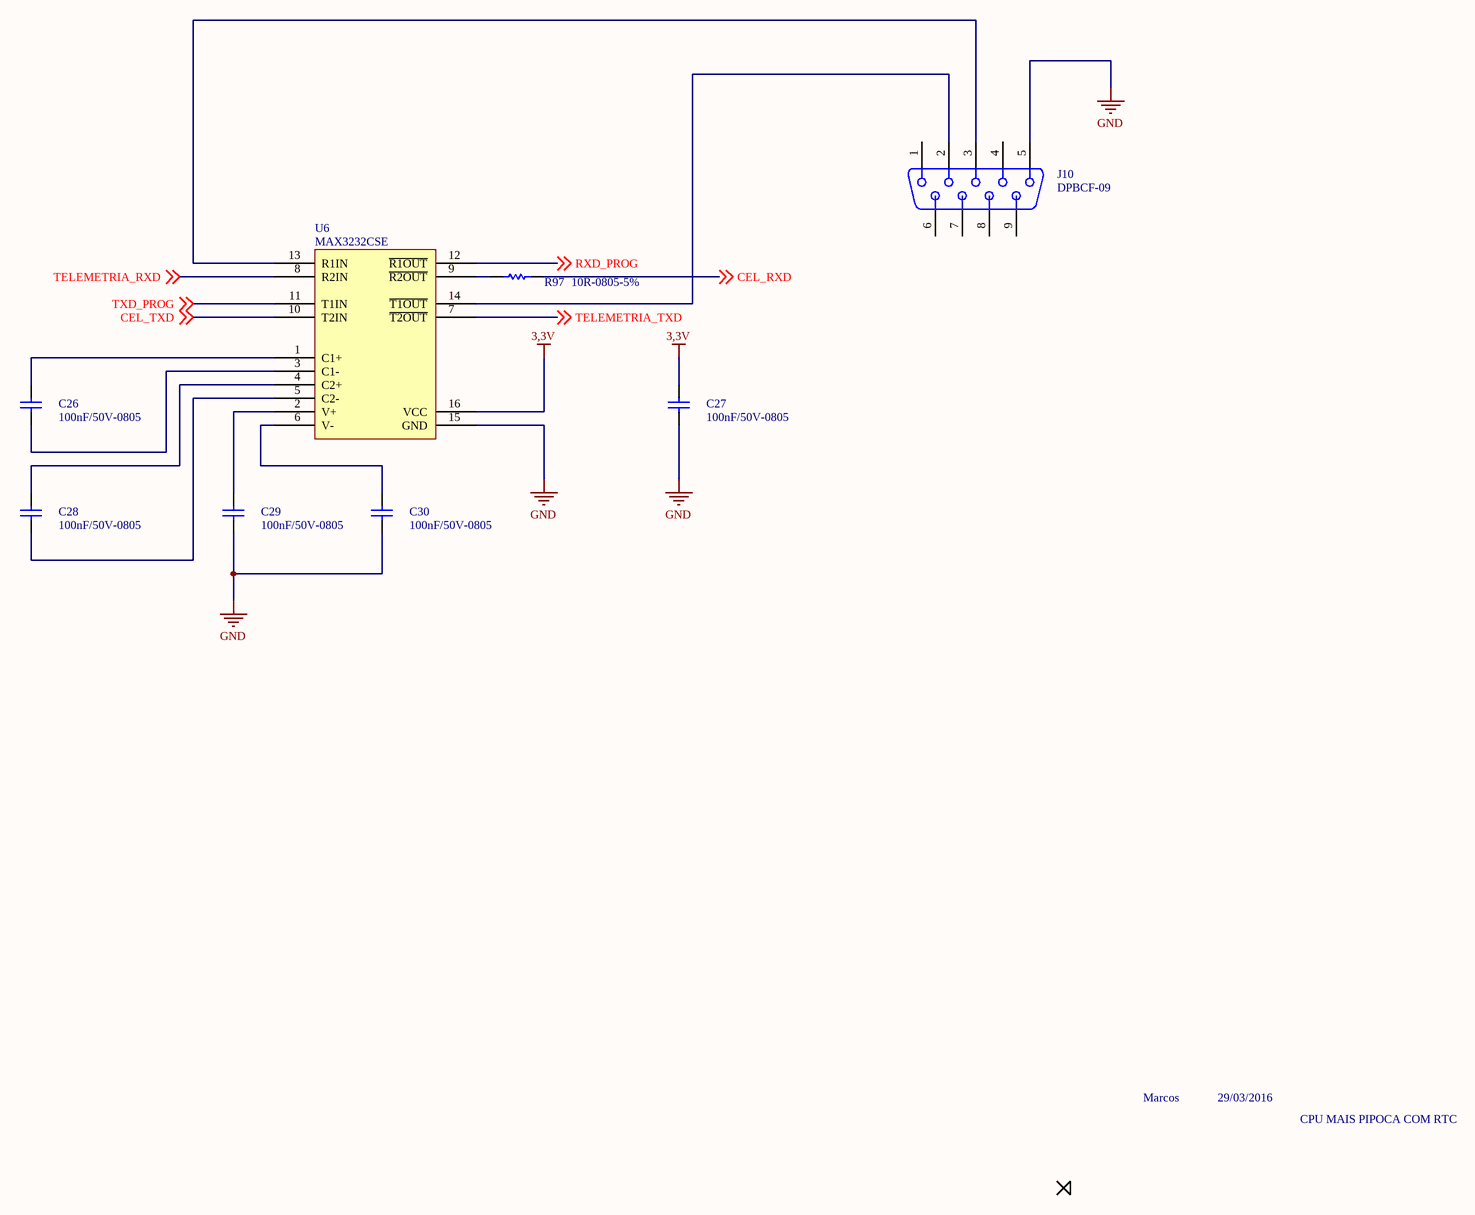
[diagram p8: InterfaceConfiguracao.SchDoc]

### Parts
C26  100nF/50V-0805  [0805-REVISADO O]
C27  100nF/50V-0805  [0805-REVISADO O]
C28  100nF/50V-0805  [0805-REVISADO O]
C29  100nF/50V-0805  [0805-REVISADO O]
C30  100nF/50V-0805  [0805-REVISADO O]
J10  DPBCF-09  [DB9-FÊMEA MONTA_DB9-FÊMEA_MONTAGEM_EM_PCI_180(Primary)]
R97  10R-0805-5%  [0805-REVISADO O]
U6  MAX3232CSE  [SOIC 16 PINOS]

### Nets
3,3V: C27.2 U6.16(VCC)
GND: C27.1 C29.1 C30.1 J10.5 U6.15(GND)
CEL_RXD: R97.2 ; off-sheet CEL_RXD
CEL_TXD: U6.10(T2IN) ; off-sheet CEL_TXD
RXD_PROG: U6.12(~{R1OUT}) ; off-sheet RXD_PROG
TELEMETRIA_RXD: U6.8(R2IN) ; off-sheet TELEMETRIA_RXD
TELEMETRIA_TXD: U6.7(~{T2OUT}) ; off-sheet TELEMETRIA_TXD
TXD_PROG: U6.11(T1IN) ; off-sheet TXD_PROG
NetC26_1: C26.1 U6.3(C1-)
NetC26_2: C26.2 U6.1(C1+)
NetC28_1: C28.1 U6.5(C2-)
NetC28_2: C28.2 U6.4(C2+)
NetC29_2: C29.2 U6.2(V+)
NetC30_2: C30.2 U6.6(V-)
NetJ10_2: J10.2 U6.14(~{T1OUT})
NetJ10_3: J10.3 U6.13(R1IN)
NetR97_1: R97.1 U6.9(~{R2OUT})

Not connected (* = marked no-connect by the designer): J10 1 4 6 7 8 9

### Notes on the sheet
- Marcos
- 29/03/2016
- CPU MAIS PIPOCA COM RTC
- NOME
- DATA
- PROJETO
- DESCRIÇÃO
- www.quarktee.com.br
- desenho
- verif.
- aprov.
- TAMANHO
- CODIGO
- Todas as informações disponíveis
- não devem ser divulgadas,
- em parte ou todo.
- CIRCUITO IMPRESSO
- MONTAGEM ELETRÔNICA
- A4
- de

### Library data of the parts
C26-C30 = 100nF/50-0805-NPO: ERP: 104.11.005
J10 = DB-9 - FÊMEA 180º MONTAGEM EM PCI: DBPCF-09; ERP: 434.00.002
R97 = 10R-0805-5%: ERP: 102.11.019
U6 = MAX3232CSE: ERP: 110.02.001

## Sheet InterfaceGSM.SchDoc: CONTROLADORA AIRPOPCORN
size A3; DocumentNumber: 10.00.0025; SheetNumber: 10; SheetTotal: 16
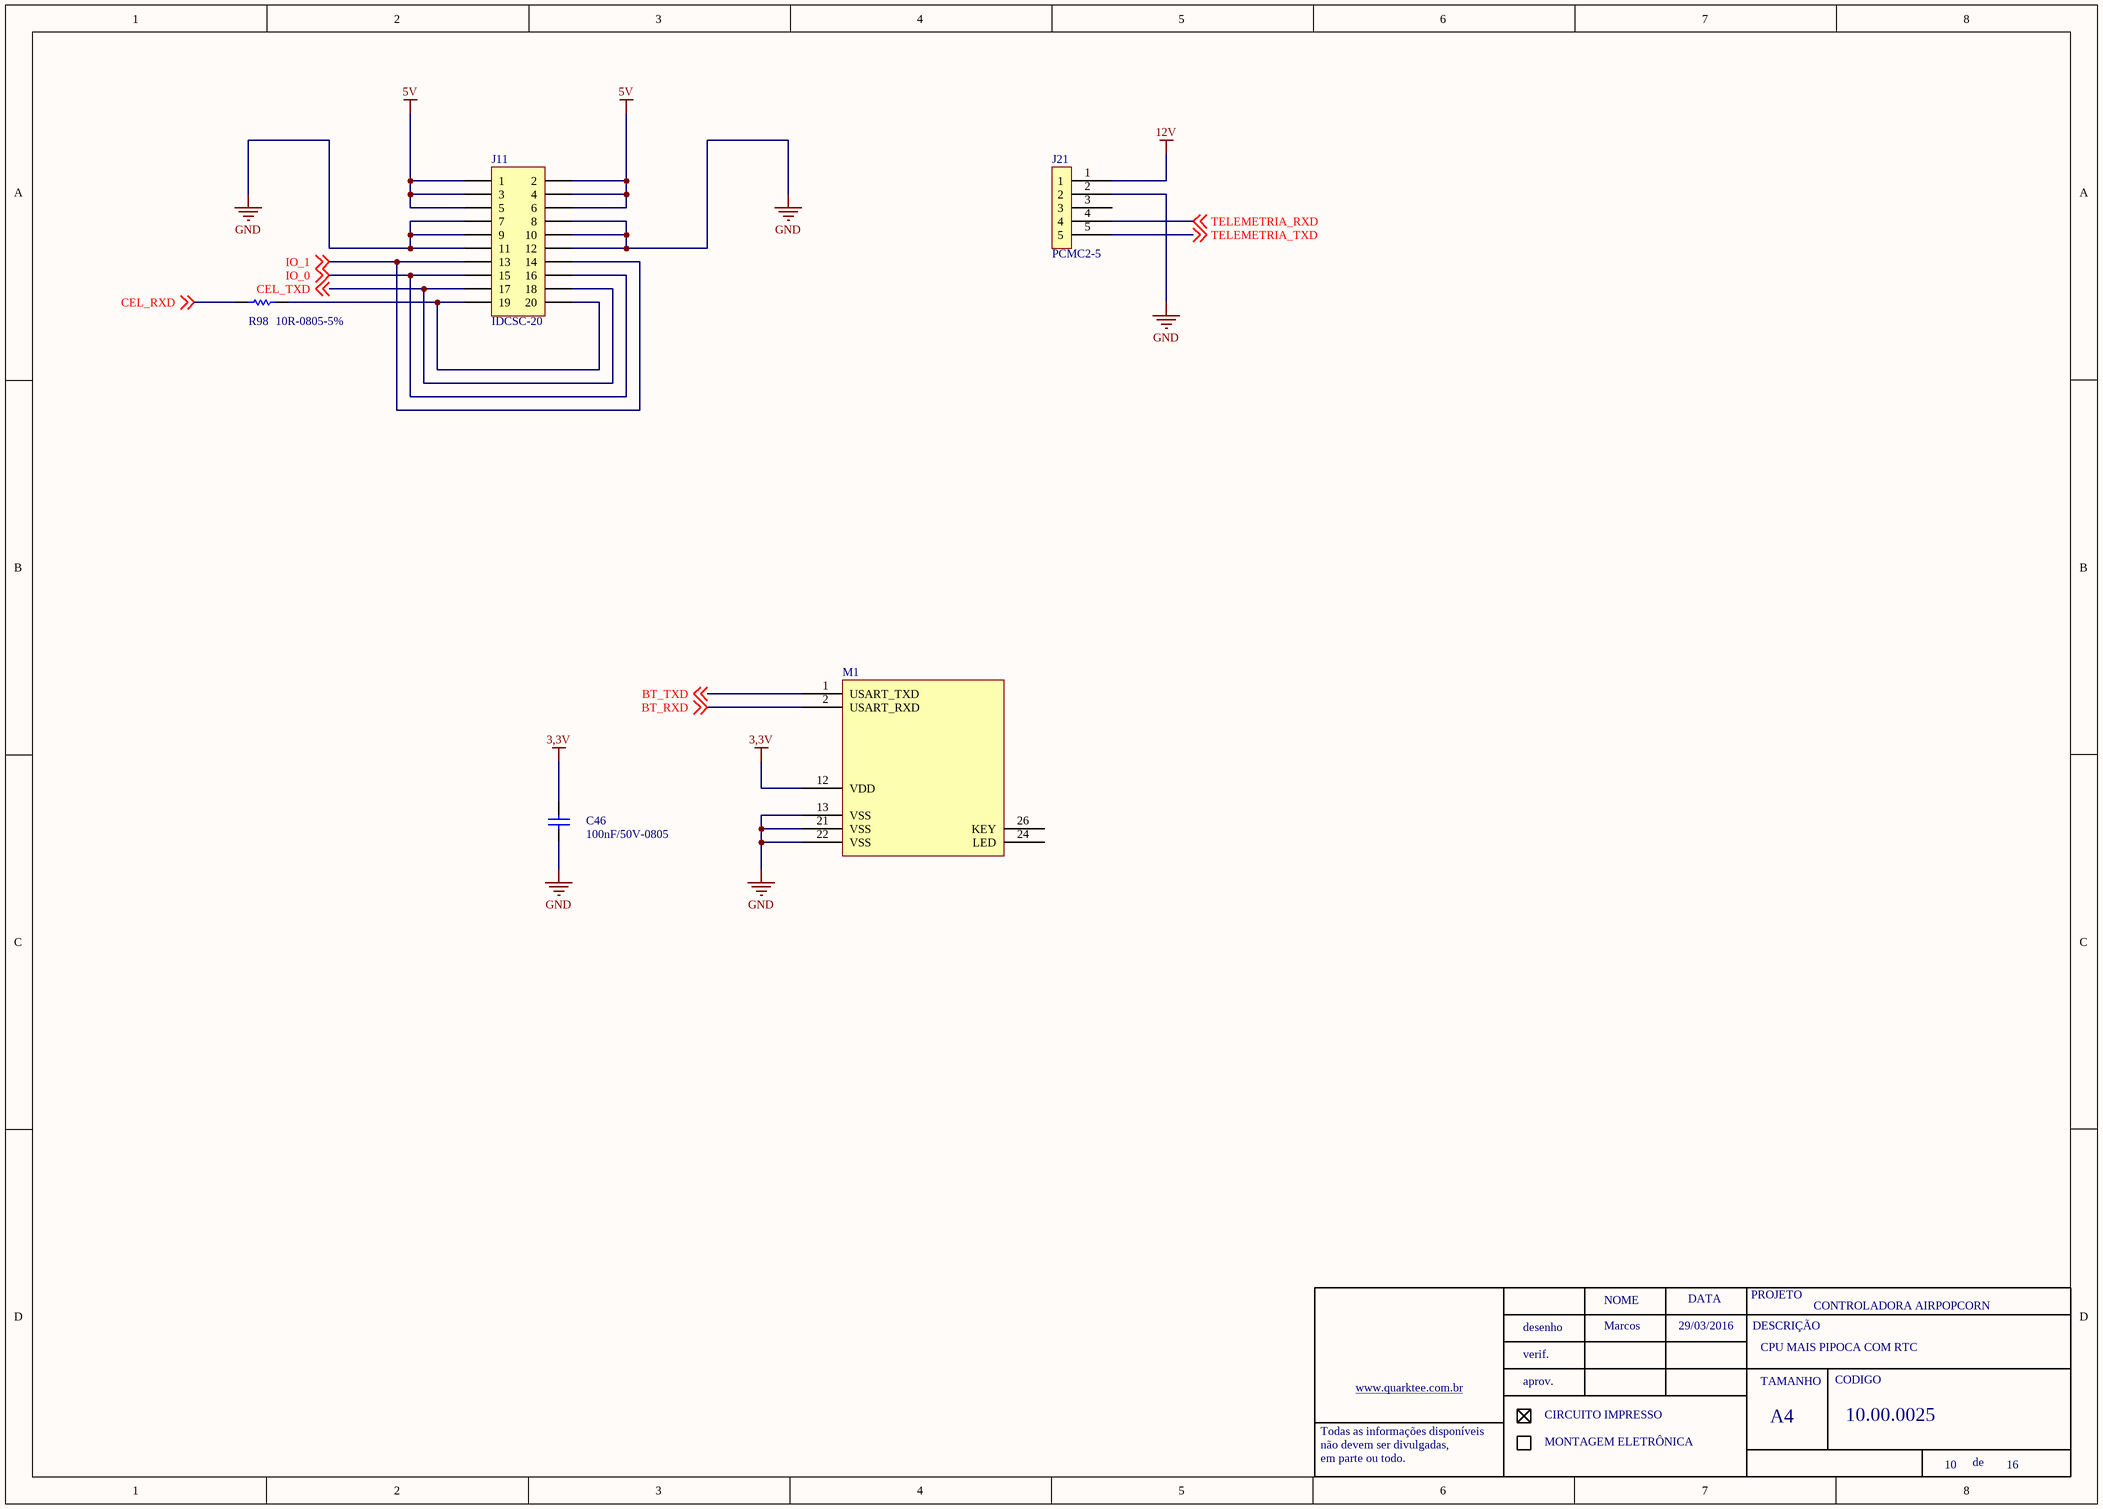
[diagram p9: InterfaceGSM.SchDoc]

### Parts
C46  100nF/50V-0805  [0805-REVISADO O]
J11  IDCSC-20  [IDCSC-20]
J21  PCMC2-5  [PCMC2-5]
M1  (no value)
R98  10R-0805-5%  [0805-REVISADO O]

### Nets
3,3V: C46.2 M1.12(VDD)
5V: J11.1 J11.2 J11.3 J11.4 J11.5 J11.6
12V: J21.1
GND: C46.1 J11.7 J11.8 J11.9 J11.10 J11.11 J11.12 J21.2 M1.13(VSS) M1.21(VSS) M1.22(VSS)
BT_RXD: M1.2(USART_RXD) ; off-sheet BT_RXD
BT_TXD: M1.1(USART_TXD) ; off-sheet BT_TXD
CEL_RXD: R98.1 ; off-sheet CEL_RXD
CEL_TXD: J11.17 J11.18 ; off-sheet CEL_TXD
IO_0: J11.15 J11.16 ; off-sheet IO_0
IO_1: J11.13 J11.14 ; off-sheet IO_1
TELEMETRIA_RXD: J21.4 ; off-sheet TELEMETRIA_RXD
TELEMETRIA_TXD: J21.5 ; off-sheet TELEMETRIA_TXD
NetJ11_19: J11.19 J11.20 R98.2

Not connected (* = marked no-connect by the designer): J21 3; M1 24(LED) 26(KEY)

### Notes on the sheet
- Marcos
- 29/03/2016
- CPU MAIS PIPOCA COM RTC
- NOME
- DATA
- PROJETO
- DESCRIÇÃO
- www.quarktee.com.br
- desenho
- verif.
- aprov.
- TAMANHO
- CODIGO
- Todas as informações disponíveis
- não devem ser divulgadas,
- em parte ou todo.
- CIRCUITO IMPRESSO
- MONTAGEM ELETRÔNICA
- A4
- de

### Library data of the parts
C46 = 100nF/50-0805-NPO: ERP: 104.11.005
J11 = IDC 10x2: ERP: 435.00.013
M1 = HC-06 BLUETOOTH: HC-06
R98 = 10R-0805-5%: ERP: 102.11.019

## Sheet InterfacePagamentos.SchDoc: CONTROLADORA AIRPOPCORN
size A3; DocumentNumber: 10.00.0025; SheetNumber: 11; SheetTotal: 16
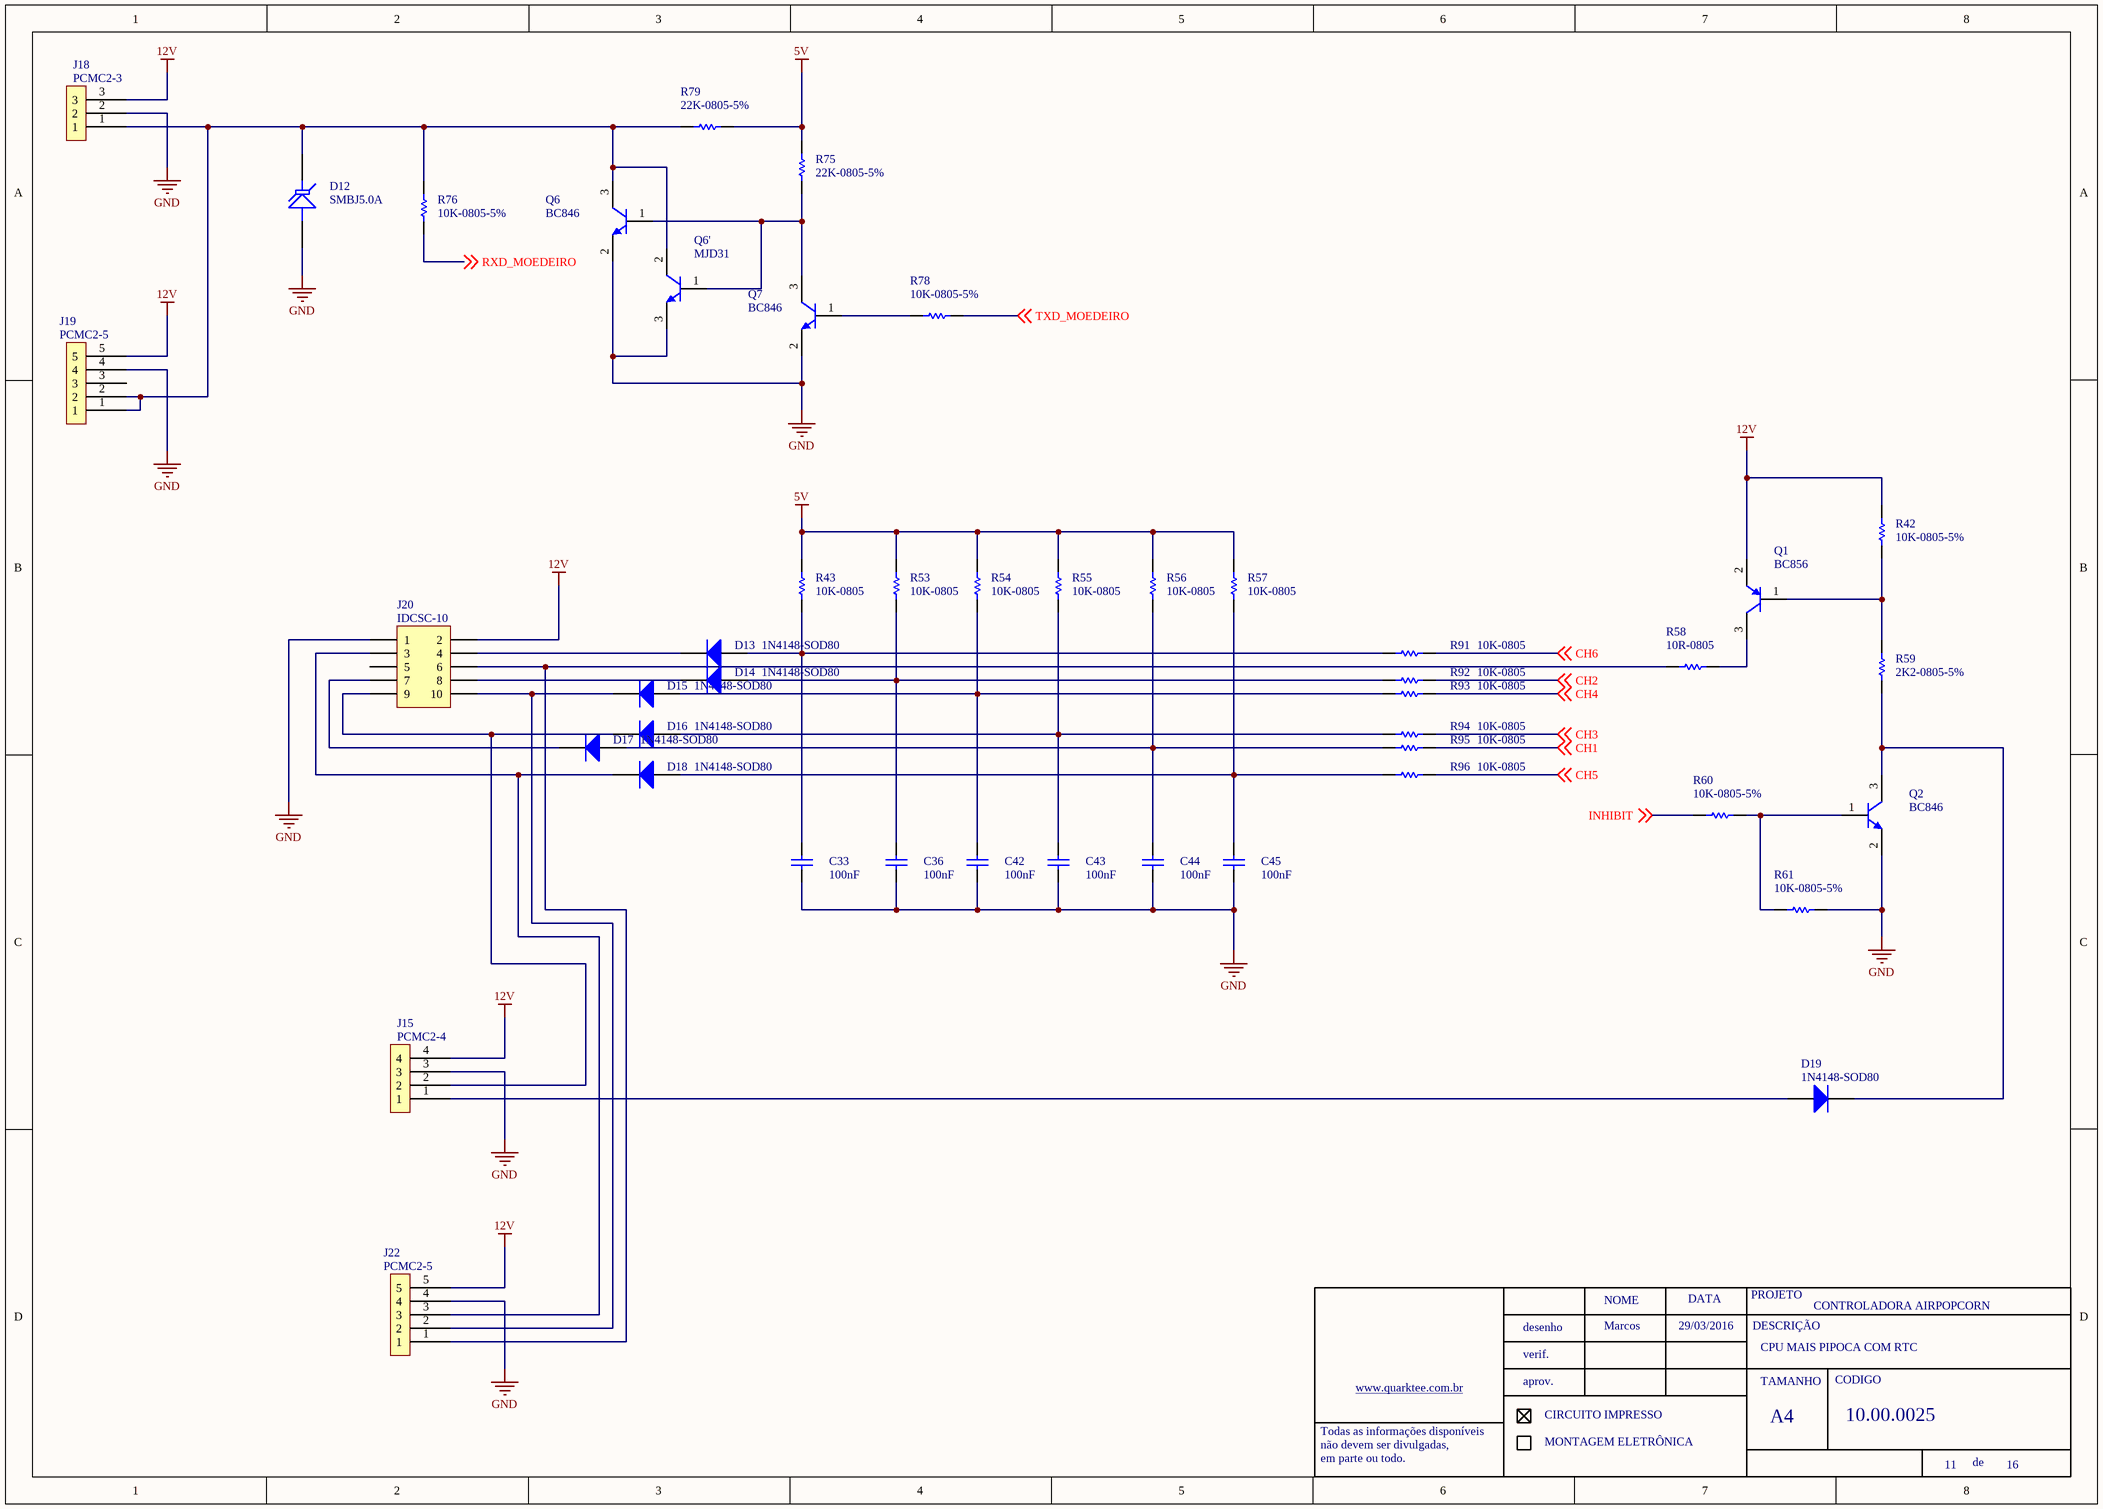
[diagram p10: InterfacePagamentos.SchDoc]

### Parts
C33  100nF  [0805-REVISADO O]
C36  100nF  [0805-REVISADO O]
C42  100nF  [0805-REVISADO O]
C43  100nF  [0805-REVISADO O]
C44  100nF  [0805-REVISADO O]
C45  100nF  [0805-REVISADO O]
D12  SMBJ5.0A  [SMB/DO-214AA]
D13  1N4148-SOD80  [MINIMLEF/SOD80]
D14  1N4148-SOD80  [MINIMLEF/SOD80]
D15  1N4148-SOD80  [MINIMLEF/SOD80]
D16  1N4148-SOD80  [MINIMLEF/SOD80]
D17  1N4148-SOD80  [MINIMLEF/SOD80]
D18  1N4148-SOD80  [MINIMLEF/SOD80]
D19  1N4148-SOD80  [MINIMLEF/SOD80]
J15  PCMC2-4  [PCMC2-4]
J18  PCMC2-3  [PCMC2-3]
J19  PCMC2-5  [PCMC2-5]
J20  IDCSC-10  [IDCSC-10]
J22  PCMC2-5  [PCMC2-5]
Q1  BC856  [SOT23 - REVISAD]
Q2  BC846  [SOT23 - REVISAD]
Q6  BC846  [SOT23 - REVISAD]
Q6'  MJD31  [DPAK REVISADO O]
Q7  BC846  [SOT23 - REVISAD]
R42  10K-0805-5%  [0805-REVISADO O]
R43  10K-0805  [0805-REVISADO O]
R53  10K-0805  [0805-REVISADO O]
R54  10K-0805  [0805-REVISADO O]
R55  10K-0805  [0805-REVISADO O]
R56  10K-0805  [0805-REVISADO O]
R57  10K-0805  [0805-REVISADO O]
R58  10R-0805  [1206-REVISADO O]
R59  2K2-0805-5%  [0805-REVISADO O]
R60  10K-0805-5%  [0805-REVISADO O]
R61  10K-0805-5%  [0805-REVISADO O]
R75  22K-0805-5%  [0805-REVISADO O]
R76  10K-0805-5%  [0805-REVISADO O]
R78  10K-0805-5%  [0805-REVISADO O]
R79  22K-0805-5%  [0805-REVISADO O]
R91  10K-0805  [0805-REVISADO O]
R92  10K-0805  [0805-REVISADO O]
R93  10K-0805  [0805-REVISADO O]
R94  10K-0805  [0805-REVISADO O]
R95  10K-0805  [0805-REVISADO O]
R96  10K-0805  [0805-REVISADO O]

### Nets
5V: R43.2 R53.2 R54.2 R55.2 R56.2 R57.2 R75.2 R79.2
12V: J15.4 J18.3 J19.5 J20.2 J22.5 Q1.2(E) R42.2
GND: C33.1 C36.1 C42.1 C43.1 C44.1 C45.1 D12.1(A) J15.3 J18.2 J19.4 J20.1 J22.4 Q2.2(E) Q6.2(E) Q6'.3(E) Q7.2(E) R61.2
CH1: R95.1 ; off-sheet CH1
CH2: R92.1 ; off-sheet CH2
CH3: R94.1 ; off-sheet CH3
CH4: R93.1 ; off-sheet CH4
CH5: R96.1 ; off-sheet CH5
CH6: R91.1 ; off-sheet CH6
INHIBIT: R60.1 ; off-sheet INHIBIT
RXD_MOEDEIRO: R76.2 ; off-sheet RXD_MOEDEIRO
TXD_MOEDEIRO: R78.2 ; off-sheet TXD_MOEDEIRO
NetC33_2: C33.2 D13.1 R43.1 R91.2
NetC36_2: C36.2 D14.1 R53.1 R92.2
NetC42_2: C42.2 D15.1 R54.1 R93.2
NetC43_2: C43.2 D16.1 R55.1 R94.2
NetC44_2: C44.2 D17.1 R56.1 R95.2
NetC45_2: C45.2 D18.1 R57.1 R96.2
NetD12_2: D12.2(K) J18.1 J19.1 J19.2 Q6.3(C) Q6'.2(C) R76.1 R79.1
NetD13_2: D13.2 J20.4
NetD14_2: D14.2 J20.8
NetD15_2: D15.2 J20.10 J22.2
NetD16_2: D16.2 J15.2 J20.9
NetD17_2: D17.2 J20.7
NetD18_2: D18.2 J20.3 J22.3
NetD19_1: D19.1 J15.1
NetD19_2: D19.2 Q2.3(C) R59.1
NetJ20_6: J20.6 J22.1 R58.2
NetQ1_1: Q1.1(B) R42.1 R59.2
NetQ1_3: Q1.3(C) R58.1
NetQ2_1: Q2.1(B) R60.2 R61.1
NetQ6_1: Q6.1(B) Q6'.1(B) Q7.3(C) R75.1
NetQ7_1: Q7.1(B) R78.1

Not connected (* = marked no-connect by the designer): J19 3; J20 5

### Notes on the sheet
- Marcos
- 29/03/2016
- CPU MAIS PIPOCA COM RTC
- NOME
- DATA
- PROJETO
- DESCRIÇÃO
- www.quarktee.com.br
- desenho
- verif.
- aprov.
- TAMANHO
- CODIGO
- Todas as informações disponíveis
- não devem ser divulgadas,
- em parte ou todo.
- CIRCUITO IMPRESSO
- MONTAGEM ELETRÔNICA
- A4
- de

### Library data of the parts
C33 C36 C42-C45 = 100nF/50-0805-NPO: ERP: 104.11.005
J20 = IDCSN: CONECTOR HEADER 10 VIAS 90º; ERP: 435.00.009
Q1 = BC856L: ERP: 106.22.002
Q2 Q6 Q7 = BC846: BC846L; ERP: 106.22.001
R43 R53-R57 R59 R91-R96 = 4K7-1206-5%: ERP: 102.12.050
R58 = 10K-0805-5%: ERP: 102.11.054
R76 = 56K-0805-5%: ERP: 102.11.063
D12 = SMBJ5.0A: ERP: 128.02.002
D13-D19 = 1N4148-SOD80: ERP: 120.19.001
R42 R60 R61 R78 = 10K-0805-5%: ERP: 102.11.054
R75 R79 = 22K-0805-5%: ERP: 102.11.058

## Sheet JTAG.SchDoc: CONTROLADORA AIRPOPCORN
size A3; DocumentNumber: 10.00.0025; SheetNumber: 12; SheetTotal: 16
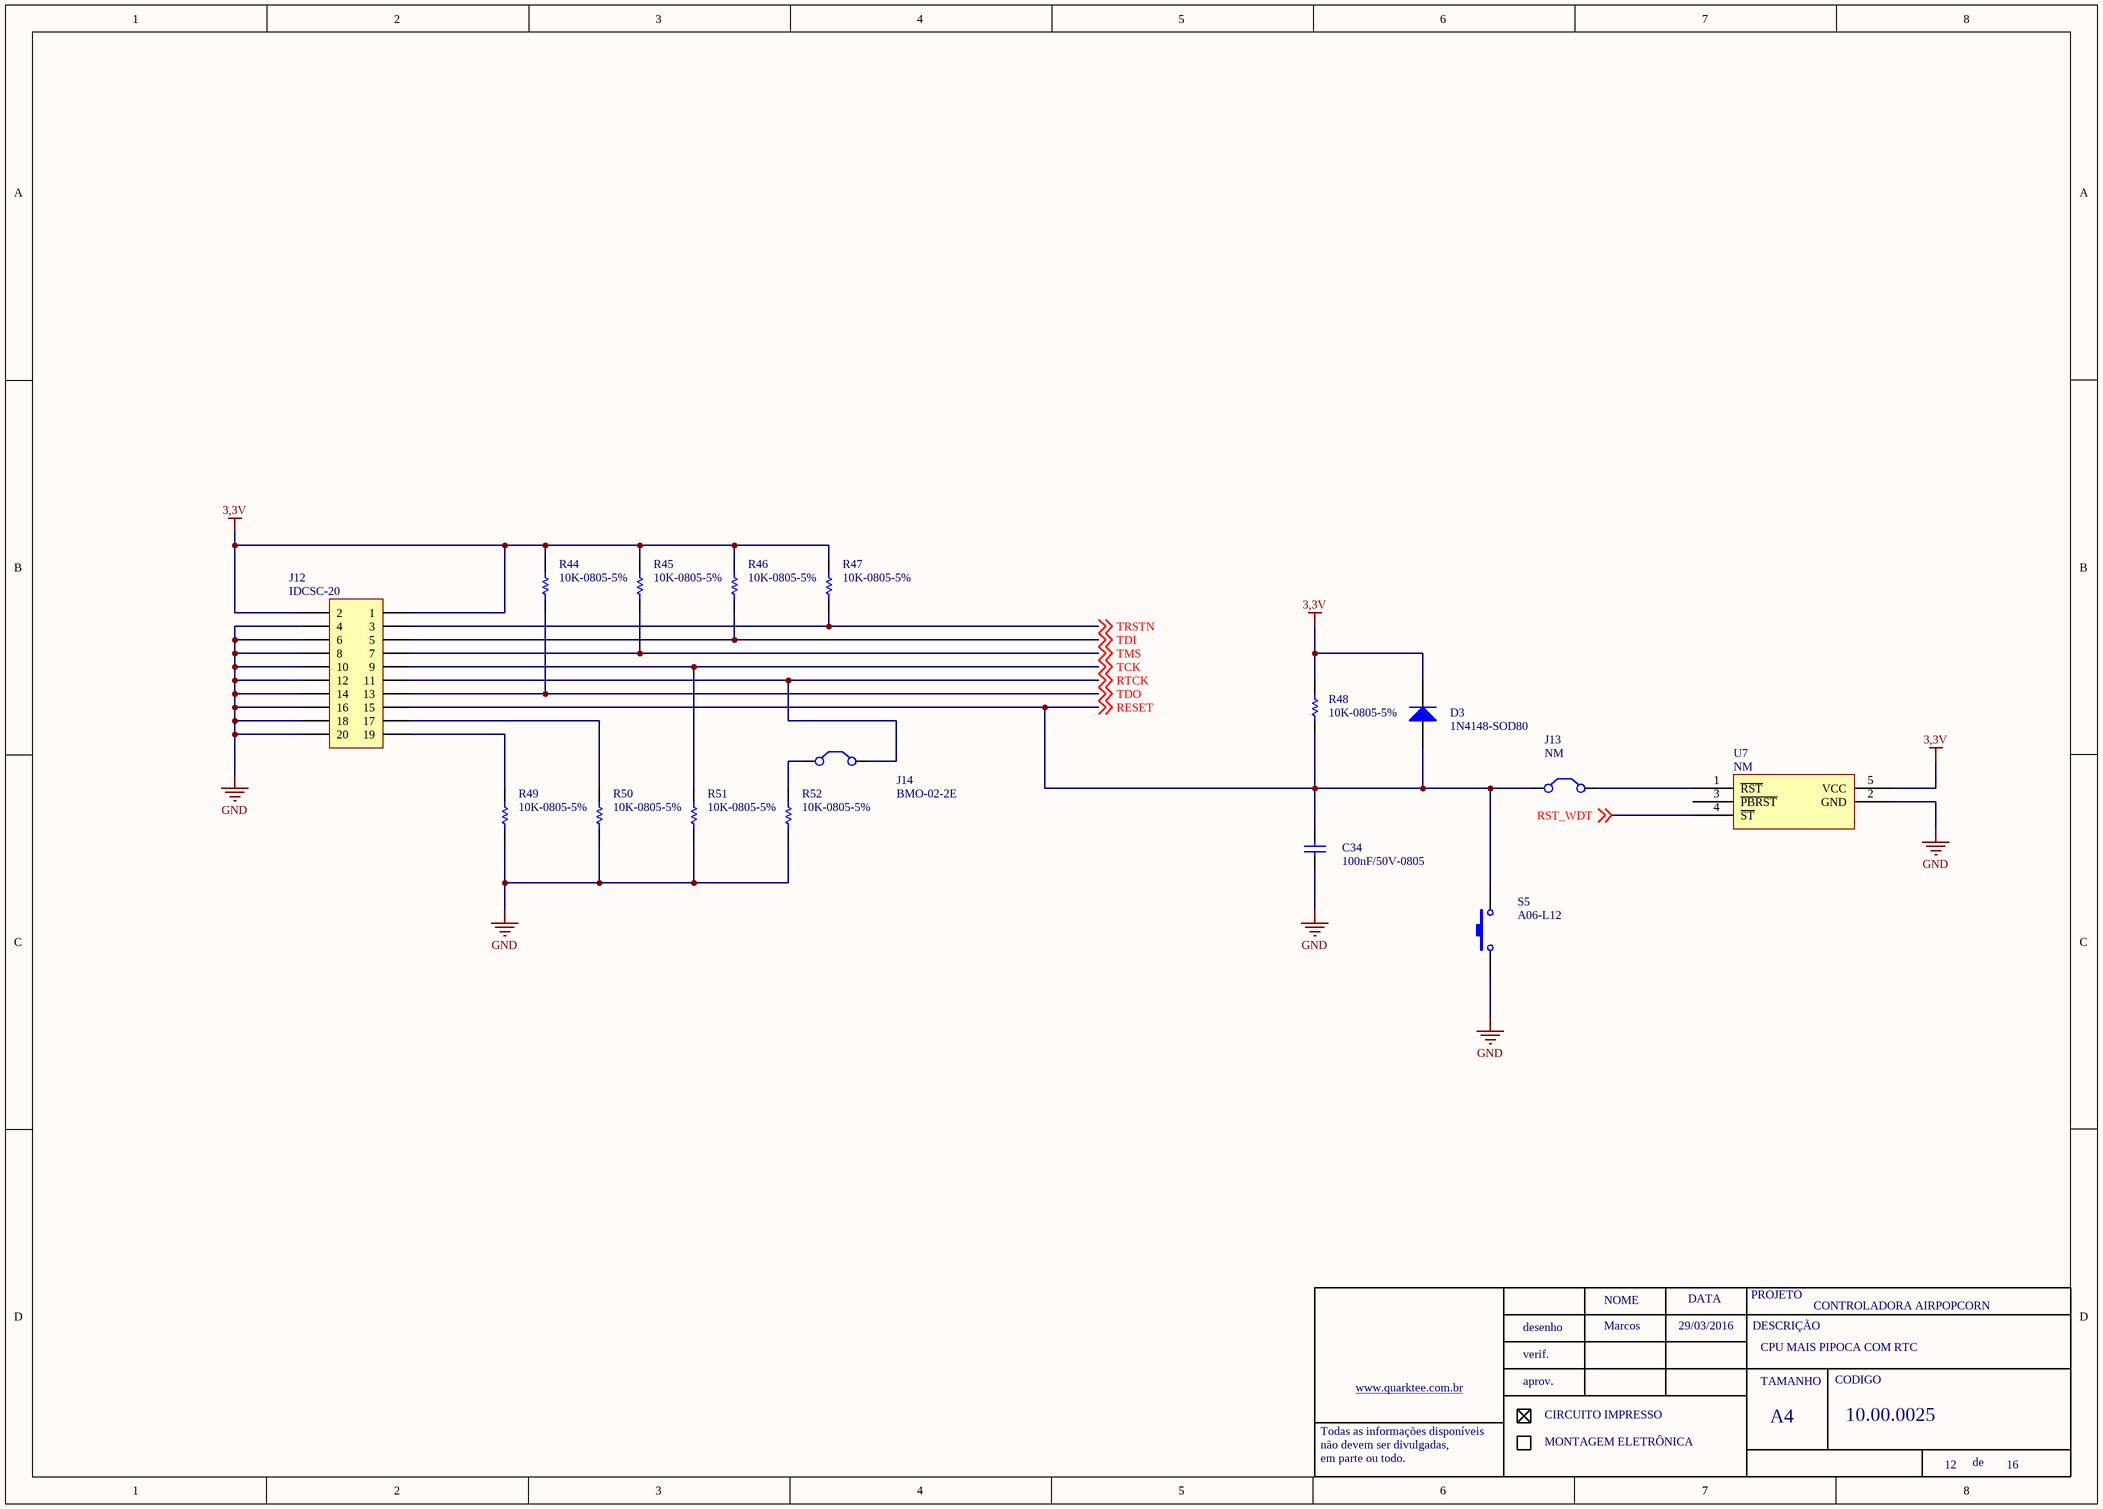
[diagram p11: JTAG.SchDoc]

### Parts
C34  100nF/50V-0805  [0805-REVISADO O]
D3  1N4148-SOD80  [MINIMLEF/SOD80]
J12  IDCSC-20  [IDCSC-20]
J13  NM  [JUMPER100]
J14  BMO-02-2E  [JUMPER100]
R44  10K-0805-5%  [0805-REVISADO O]
R45  10K-0805-5%  [0805-REVISADO O]
R46  10K-0805-5%  [0805-REVISADO O]
R47  10K-0805-5%  [0805-REVISADO O]
R48  10K-0805-5%  [0805-REVISADO O]
R49  10K-0805-5%  [0805-REVISADO O]
R50  10K-0805-5%  [0805-REVISADO O]
R51  10K-0805-5%  [0805-REVISADO O]
R52  10K-0805-5%  [0805-REVISADO O]
S5  A06-L12  [CHAVE TACTIL NO_[125](Primary)]
U7  NM  [SOT23-5]

### Nets
3,3V: D3.2 J12.1 J12.2 R44.1 R45.1 R46.1 R47.1 R48.2 U7.5(VCC)
GND: C34.1 J12.4 J12.6 J12.8 J12.10 J12.12 J12.14 J12.16 J12.18 J12.20 R49.2 R50.2 R51.2 R52.2 S5.1 U7.2(GND)
RESET: C34.2 D3.1 J12.15 J13.1(C1) R48.1 S5.2 ; off-sheet RESET
RST_WDT: U7.4(~{ST}) ; off-sheet RST_WDT
RTCK: J12.11 J14.2(C2) ; off-sheet RTCK
TCK: J12.9 R51.1 ; off-sheet TCK
TDI: J12.5 R46.2 ; off-sheet TDI
TDO: J12.13 R44.2 ; off-sheet TDO
TMS: J12.7 R45.2 ; off-sheet TMS
TRSTN: J12.3 R47.2 ; off-sheet TRSTN
NetJ12_17: J12.17 R50.1
NetJ12_19: J12.19 R49.1
NetJ13_2: J13.2(C2) U7.1(~{RST})
NetJ14_1: J14.1(C1) R52.1

Not connected (* = marked no-connect by the designer): U7 3(~{PBRST})

### Notes on the sheet
- Marcos
- 29/03/2016
- CPU MAIS PIPOCA COM RTC
- NOME
- DATA
- PROJETO
- DESCRIÇÃO
- www.quarktee.com.br
- desenho
- verif.
- aprov.
- TAMANHO
- CODIGO
- Todas as informações disponíveis
- não devem ser divulgadas,
- em parte ou todo.
- CIRCUITO IMPRESSO
- MONTAGEM ELETRÔNICA
- A4
- de

### Library data of the parts
C34 = 100nF/50-0805-NPO: ERP: 104.11.005
J12 = HEADER 10x2: BARRA DE PINOS 10x2 VIAS; ERP: 10 x 434.00.060
J13 = BARRA DE PINOS: BMO-02-2E; ERP: 434.00.060
J14 = BARRA DE PINOS: ERP: 434.00.060
R44-R47 R49-R52 = RES 10K-0805: ERP: 103.03.054
U7 = DS1819A: ERP: FALTA CADASTRAR
D3 = 1N4148-SOD80: ERP: 120.19.001
R48 = 10K-0805-5%: ERP: 102.11.054
S5 = A06-L12: ERP: 136.00.001

## Sheet Memoria.SchDoc: CONTROLADORA AIRPOPCORN
size A3; DocumentNumber: 10.00.0025; SheetNumber: 13; SheetTotal: 16
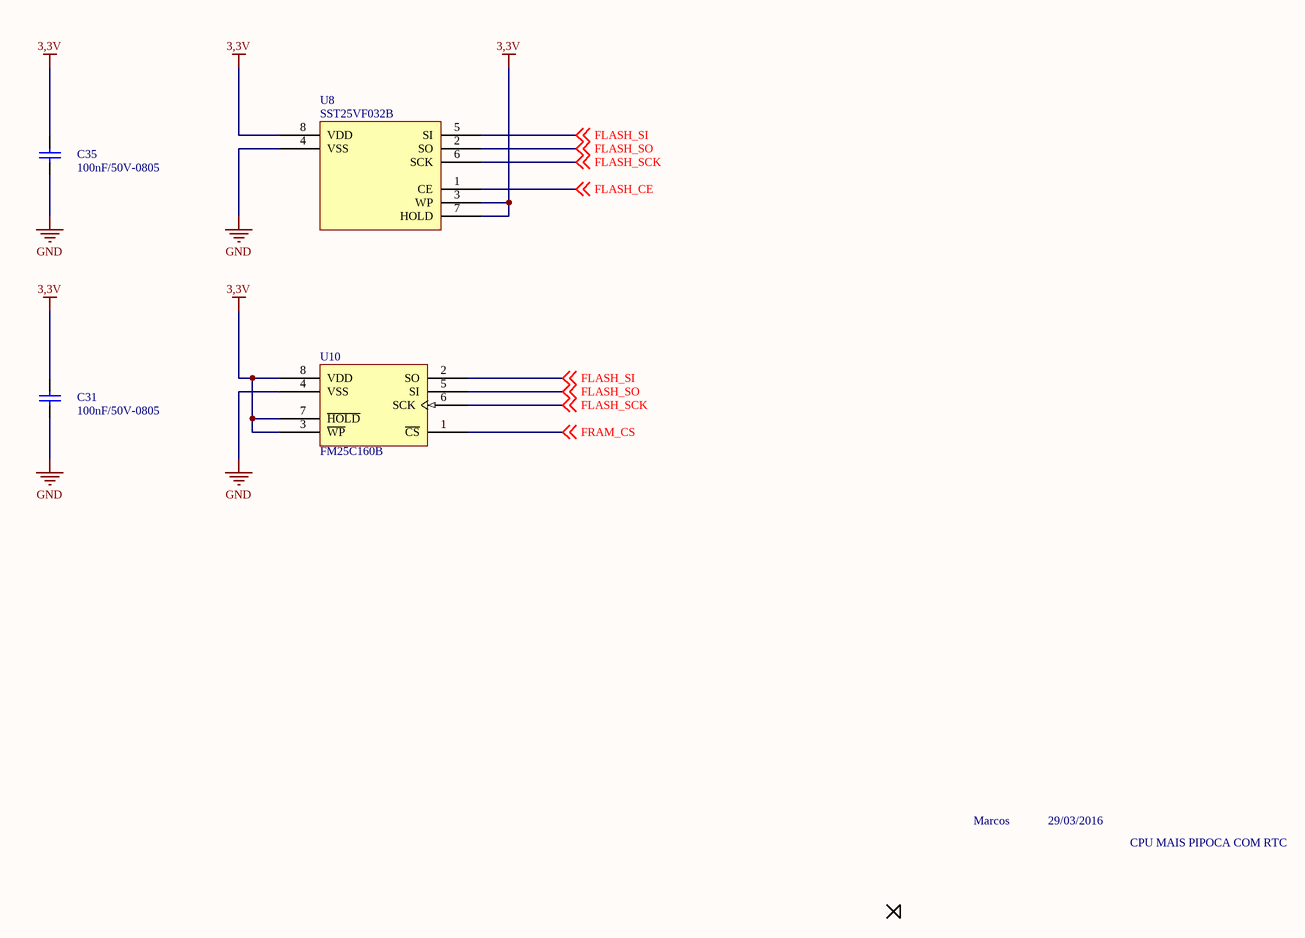
[diagram p12: Memoria.SchDoc]

### Parts
C31  100nF/50V-0805  [0805-REVISADO O]
C35  100nF/50V-0805  [0805-REVISADO O]
U8  SST25VF032B  [SOIC LARGO ATME]
U10  FM25C160B  [SOIC-08]

### Nets
3,3V: C31.2 C35.2 U8.3(WP) U8.7(HOLD) U8.8(VDD) U10.3(~{WP}) U10.7(~{HOLD}) U10.8(VDD)
GND: C31.1 C35.1 U8.4(VSS) U10.4(VSS)
FLASH_CE: U8.1(CE) ; off-sheet FLASH_CE
FLASH_SCK: U8.6(SCK) U10.6(SCK) ; off-sheet FLASH_SCK
FLASH_SI: U8.5(SI) U10.2(SO) ; off-sheet FLASH_SI
FLASH_SO: U8.2(SO) U10.5(SI) ; off-sheet FLASH_SO
FRAM_CS: U10.1(~{CS}) ; off-sheet FRAM_CS

### Notes on the sheet
- Marcos
- 29/03/2016
- CPU MAIS PIPOCA COM RTC
- NOME
- DATA
- PROJETO
- DESCRIÇÃO
- www.quarktee.com.br
- desenho
- verif.
- aprov.
- TAMANHO
- CODIGO
- Todas as informações disponíveis
- não devem ser divulgadas,
- em parte ou todo.
- CIRCUITO IMPRESSO
- MONTAGEM ELETRÔNICA
- A4
- de

### Library data of the parts
C31 C35 = 100nF/50-0805-NPO: ERP: 104.11.005
U8 = SST25VF032B: ERP: FALTA CADASTRAR

## Sheet ModuloCelular.SchDoc
size A3; DocumentNumber: 10.00.0025; SheetNumber: 14; SheetTotal: 16

### Notes on the sheet
- NOME
- DATA
- PROJETO
- DESCRIÇÃO
- desenho
- verif.
- aprov.
- TAMANHO
- CODIGO
- Todas as informações disponíveis
- não devem ser divulgadas,
- em parte ou todo.
- CIRCUITO IMPRESSO
- MONTAGEM ELETRÔNICA
- A4
- de

## Sheet Regulador.SchDoc: CONTROLADORA AIRPOPCORN
size A3; DocumentNumber: 10.00.0025; SheetNumber: 15; SheetTotal: 16
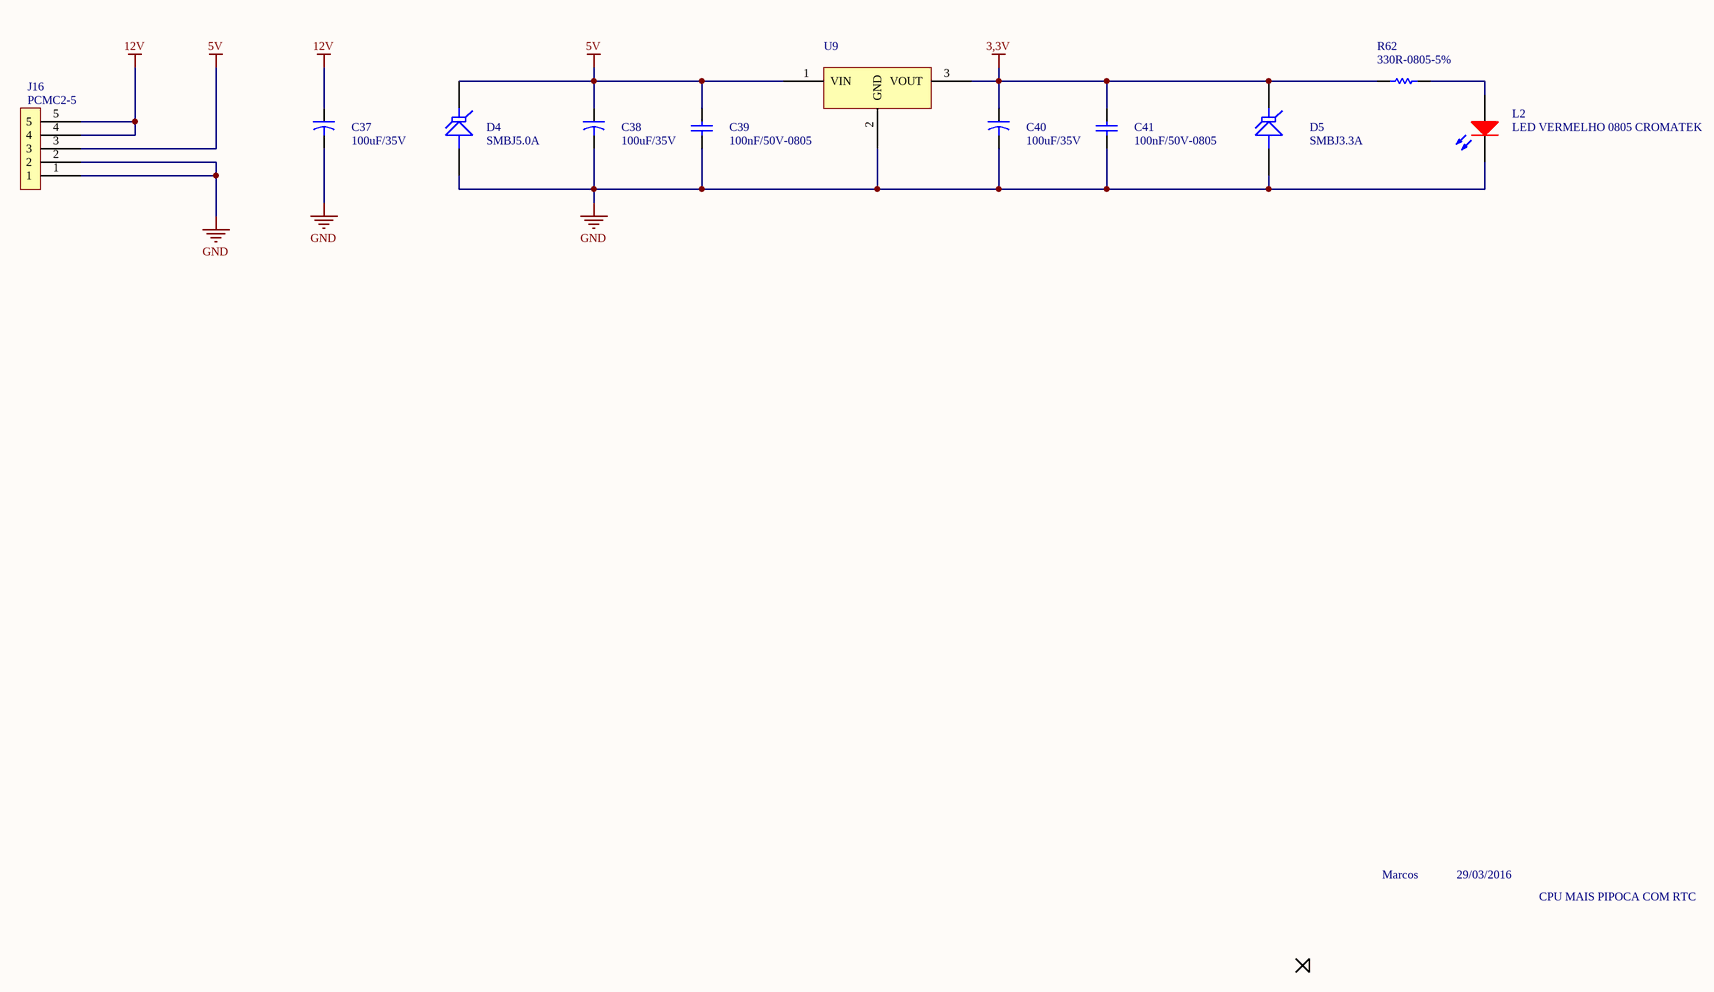
[diagram p13: Regulador.SchDoc]

### Parts
C37  100uF/35V  [CAP POL 8x12mm]
C38  100uF/35V  [CAP POL 8x12mm]
C39  100nF/50V-0805  [0805-REVISADO O]
C40  100uF/35V  [CAP POL 8x12mm]
C41  100nF/50V-0805  [0805-REVISADO O]
D4  SMBJ5.0A  [SMB/DO214AA-REV]
D5  SMBJ3.3A  [SMB/DO214AA-REV]
J16  PCMC2-5  [PCMC2-5]
L2  LED VERMELHO 0805 CROMATEK  [LED 0805 - REVI]
R62  330R-0805-5%  [0805-REVISADO O]
U9  (no value)  [TO-263_3]

### Nets
3,3V: C40.1 C41.2 D5.2(K) R62.1 U9.3(VOUT)
5V: C38.1 C39.2 D4.2(K) J16.3 U9.1(VIN)
12V: C37.1 J16.4 J16.5
GND: C37.2 C38.2 C39.1 C40.2 C41.1 D4.1(A) D5.1(A) J16.1 J16.2 L2.2(K) U9.2(GND)
NetL2_1: L2.1(A) R62.2

### Notes on the sheet
- Marcos
- 29/03/2016
- CPU MAIS PIPOCA COM RTC
- NOME
- DATA
- PROJETO
- DESCRIÇÃO
- www.quarktee.com.br
- desenho
- verif.
- aprov.
- TAMANHO
- CODIGO
- Todas as informações disponíveis
- não devem ser divulgadas,
- em parte ou todo.
- CIRCUITO IMPRESSO
- MONTAGEM ELETRÔNICA
- A4
- de

### Library data of the parts
C37 C38 C40 = 100uF/50V: ERP: 105.01.003
C39 C41 = 100nF/50-0805-NPO: ERP: 104.11.005
D5 = SMBJ5.0A: ERP: 128.02.002
L2 = LED VERMELHO 0603 SMD: ERP: 124.02.010
R62 = 1K-0805-5%: ERP: 102.11.042
U9 = LM3940IT-3.3-TO220: ERP: 115.01.001
D4 = SMBJ5.0A: ERP: 128.02.002

## Sheet SaidasMotoresCC.SchDoc: CONTROLADORA AIRPOPCORN
size A3; DocumentNumber: 10.00.0025; SheetNumber: 16; SheetTotal: 16
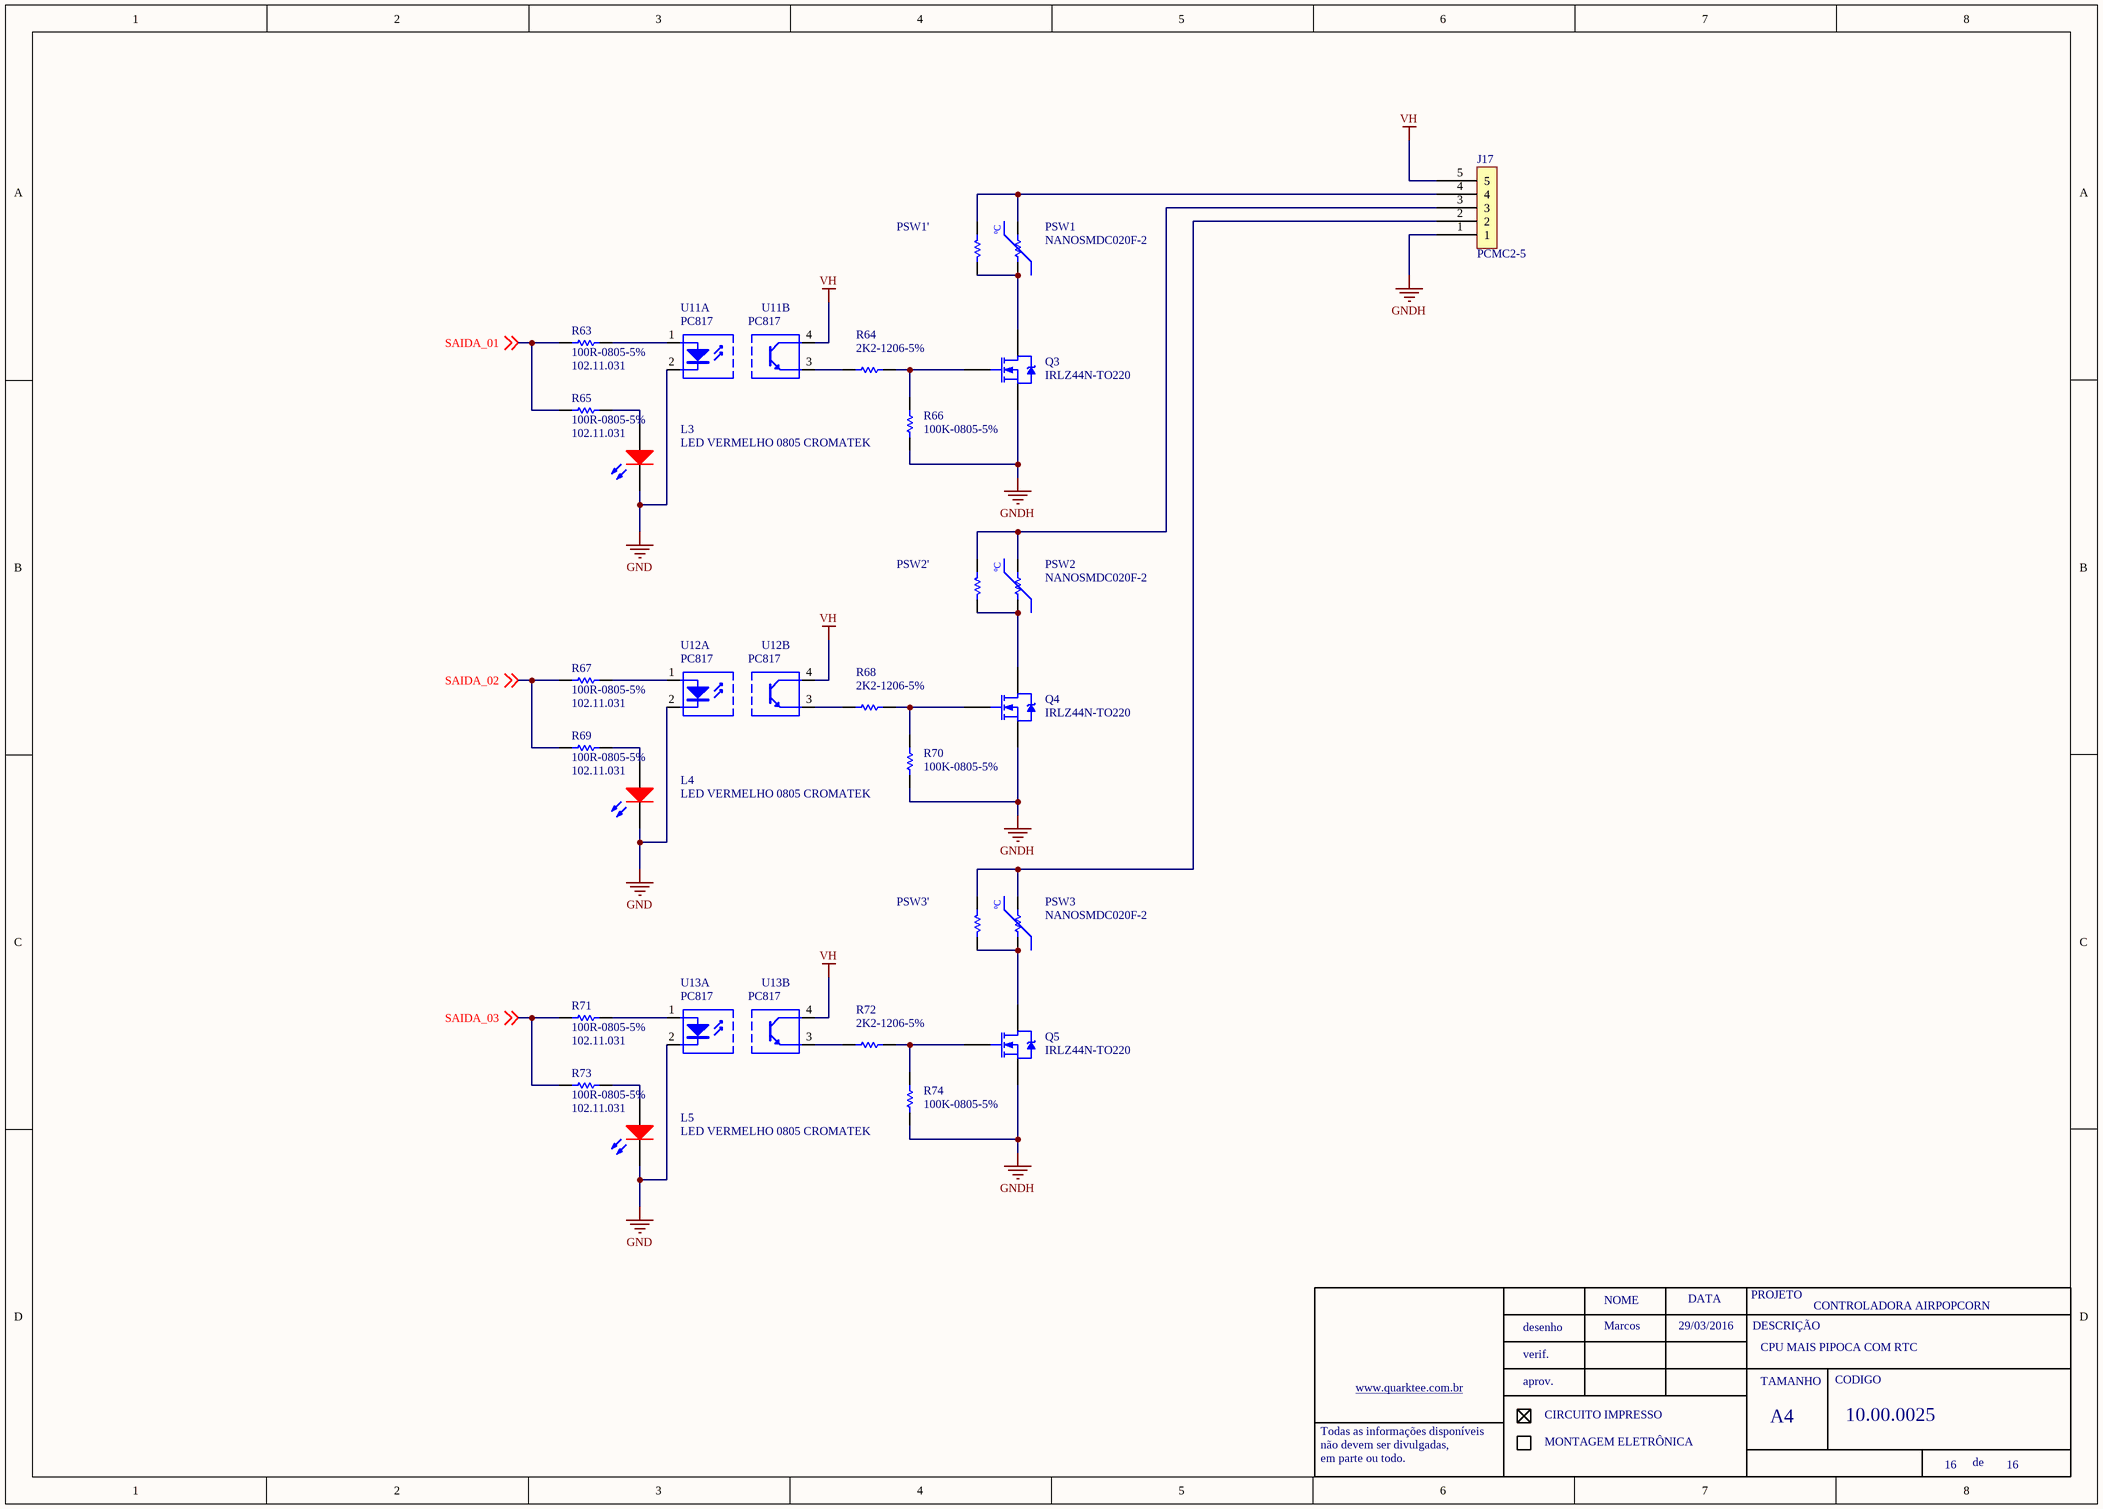
[diagram p14: SaidasMotoresCC.SchDoc]

### Parts
J17  PCMC2-5  [PCMC2-5]
L3  LED VERMELHO 0805 CROMATEK  [LED 0805 - REVI]
L4  LED VERMELHO 0805 CROMATEK  [LED 0805 - REVI]
L5  LED VERMELHO 0805 CROMATEK  [LED 0805 - REVI]
PSW1  NANOSMDC020F-2  [2512 - REVISADO]
PSW1'  (no value)  [1206-REVISADO O]
PSW2  NANOSMDC020F-2  [2512 - REVISADO]
PSW2'  (no value)  [1206-REVISADO O]
PSW3  NANOSMDC020F-2  [2512 - REVISADO]
PSW3'  (no value)  [1206-REVISADO O]
Q3  IRLZ44N-TO220  [TO220-3 EM PÉ]
Q4  IRLZ44N-TO220  [TO220-3 EM PÉ]
Q5  IRLZ44N-TO220  [TO220-3 EM PÉ]
R63  100R-0805-5%  ERP: 102.11.031  [0805-REVISADO O]
R64  2K2-1206-5%  [1206-REVISADO O]
R65  100R-0805-5%  ERP: 102.11.031  [0805-REVISADO O]
R66  100K-0805-5%  [0805-REVISADO O]
R67  100R-0805-5%  ERP: 102.11.031  [0805-REVISADO O]
R68  2K2-1206-5%  [1206-REVISADO O]
R69  100R-0805-5%  ERP: 102.11.031  [0805-REVISADO O]
R70  100K-0805-5%  [0805-REVISADO O]
R71  100R-0805-5%  ERP: 102.11.031  [0805-REVISADO O]
R72  2K2-1206-5%  [1206-REVISADO O]
R73  100R-0805-5%  ERP: 102.11.031  [0805-REVISADO O]
R74  100K-0805-5%  [0805-REVISADO O]
U11  PC817  [DIP-4]  (parts A,B of 2)
U12  PC817  [DIP-4]  (parts A,B of 2)
U13  PC817  [DIP-4]  (parts A,B of 2)

### Nets
GND: L3.2(K) L4.2(K) L5.2(K) U11.2(K) U12.2(K) U13.2(K)
GNDH: J17.1 Q3.3(S) Q4.3(S) Q5.3(S) R66.1 R70.1 R74.1
VH: J17.5 U11.4(C) U12.4(C) U13.4(C)
SAIDA_01: R63.1 R65.1 ; off-sheet SAIDA_01
SAIDA_02: R67.1 R69.1 ; off-sheet SAIDA_02
SAIDA_03: R71.1 R73.1 ; off-sheet SAIDA_03
NetJ17_2: J17.2 PSW3.2 PSW3'.1
NetJ17_3: J17.3 PSW2.2 PSW2'.1
NetJ17_4: J17.4 PSW1.2 PSW1'.1
NetL3_1: L3.1(A) R65.2
NetL4_1: L4.1(A) R69.2
NetL5_1: L5.1(A) R73.2
NetPSW1_1: PSW1.1 PSW1'.2 Q3.2(D)
NetPSW2_1: PSW2.1 PSW2'.2 Q4.2(D)
NetPSW3_1: PSW3.1 PSW3'.2 Q5.2(D)
NetQ3_1: Q3.1(G) R64.1 R66.2
NetQ4_1: Q4.1(G) R68.1 R70.2
NetQ5_1: Q5.1(G) R72.1 R74.2
NetR63_2: R63.2 U11.1(A)
NetR64_2: R64.2 U11.3(E)
NetR67_2: R67.2 U12.1(A)
NetR68_2: R68.2 U12.3(E)
NetR71_2: R71.2 U13.1(A)
NetR72_2: R72.2 U13.3(E)

### Notes on the sheet
- Marcos
- 29/03/2016
- CPU MAIS PIPOCA COM RTC
- NOME
- DATA
- PROJETO
- DESCRIÇÃO
- www.quarktee.com.br
- desenho
- verif.
- aprov.
- TAMANHO
- CODIGO
- Todas as informações disponíveis
- não devem ser divulgadas,
- em parte ou todo.
- CIRCUITO IMPRESSO
- MONTAGEM ELETRÔNICA
- A4
- de
- (in symbol POLYSWITCH 200mA) ºC

### Library data of the parts
L3-L5 = LED VERMELHO 0603 SMD: ERP: 124.02.010
PSW1-PSW3 = POLYSWITCH 200mA: ERP: 128.12.002
PSW1' PSW2' PSW3' R64 R68 R72 = 100K-0805-5%: ERP: 102.11.066
U11-U13 = PC817: OPTOACOPLADOR PC817 DIP-4
Q3-Q5 = IRLZ44N-TO220: ERP: 107.01.006
R66 R70 R74 = 100K-0805-5%: ERP: 102.11.066

## Nets that join several sheets
3,3V: ControleLeds (6 pins), CPU (21 pins), EntradaSensores (8 pins), EntradaSensorTemperatura (J8.2), IHM (R25.1 R26.1 R27.1 R28.1), InterfaceConfiguracao (C27.2 U6.16), InterfaceGSM (C46.2 M1.12), JTAG (9 pins), Memoria (8 pins), Regulador (5 pins)
5V: IHM (12 pins), InterfaceGSM (6 pins), InterfacePagamentos (8 pins), Regulador (5 pins)
12V: ControleLeds (J2.9 J23.1), InterfaceGSM (J21.1), InterfacePagamentos (7 pins), Regulador (C37.1 J16.4 J16.5)
GND: amplificadorAudio (10 pins), ControleLeds (10 pins), ControlePotencia (C49.1 J3.1), CPU (22 pins), EntradaSensores (10 pins), EntradaSensorTemperatura (C22.1 C32.1 D11.1 R24.1), IHM (22 pins), InterfaceConfiguracao (5 pins), InterfaceGSM (11 pins), InterfacePagamentos (17 pins), JTAG (16 pins), Memoria (C31.1 C35.1 U8.4 U10.4), Regulador (11 pins), SaidasMotoresCC (6 pins)
AUDIO: amplificadorAudio (R1.1), CPU (U4.6)
BT_RXD: CPU (U4.48), InterfaceGSM (M1.2)
BT_TXD: CPU (U4.49), InterfaceGSM (M1.1)
CEL_RXD: CPU (U4.74), InterfaceConfiguracao (R97.2), InterfaceGSM (R98.1)
CEL_TXD: CPU (U4.75), InterfaceConfiguracao (U6.10), InterfaceGSM (J11.17 J11.18)
CH1: CPU (U4.82), InterfacePagamentos (R95.1)
CH2: CPU (U4.85), InterfacePagamentos (R92.1)
CH3: CPU (U4.57), InterfacePagamentos (R94.1)
CH4: CPU (U4.56), InterfacePagamentos (R93.1)
CH5: CPU (U4.29), InterfacePagamentos (R96.1)
CH6: CPU (U4.30), InterfacePagamentos (R91.1)
DEC: CPU (U4.90), IHM (R27.2 S3.2)
ENTER: CPU (U4.89), IHM (R28.2 S4.2)
ESC: CPU (U4.92), IHM (R25.2 S1.2)
FIM_DO_PAPEL: CPU (U4.33), EntradaSensores (C20.2 D2.2 R15.2)
FLASH_CE: CPU (U4.63), Memoria (U8.1)
FLASH_SCK: CPU (U4.62), Memoria (U8.6 U10.6)
FLASH_SI: CPU (U4.60), Memoria (U8.5 U10.2)
FLASH_SO: CPU (U4.61), Memoria (U8.2 U10.5)
FRAM_CS: CPU (U4.59), Memoria (U10.1)
GP_0: CPU (U4.45), EntradaSensores (R20.2)
GP_1: CPU (U4.21), EntradaSensores (R21.2)
GP_2: CPU (U4.20), EntradaSensores (R22.2)
INC: CPU (U4.91), IHM (R26.2 S2.2)
INHIBIT: CPU (U4.27), InterfacePagamentos (R60.1)
IO_0: CPU (U4.36), InterfaceGSM (J11.15 J11.16)
IO_1: CPU (U4.37), InterfaceGSM (J11.13 J11.14)
LCD2_D4: CPU (U4.67), IHM (U5.4)
LCD2_D5: CPU (U4.66), IHM (U5.5)
LCD2_D6: CPU (U4.65), IHM (U5.6)
LCD2_D7: CPU (U4.64), IHM (U5.7)
LCD2_ENABLE: CPU (U4.69), IHM (U5.3)
LCD2_RS: CPU (U4.68), IHM (U5.2)
LCD_D4: CPU (U4.78), IHM (R34.2)
LCD_D5: CPU (U4.79), IHM (R32.2)
LCD_D6: CPU (U4.80), IHM (R31.2)
LCD_D7: CPU (U4.81), IHM (R30.2)
LCD_ENABLE: CPU (U4.77), IHM (LCD1.6 LCD2.6)
LCD_RS: CPU (U4.76), IHM (LCD1.4 LCD2.4)
LEDS_CLOCK: ControleLeds (U2.11 U14.11), CPU (R40.1 U4.24)
LEDS_DATA: ControleLeds (U2.14), CPU (U4.32)
LEDS_STROBE: ControleLeds (U2.12 U14.12), CPU (R39.1 U4.25)
LIGA_NEUTRO_POT: ControlePotencia (R10.1), CPU (U4.8)
PULSO_CONT_MOTOR: ControlePotencia (R8.1), CPU (U4.73)
PULSO_CONT_RES: ControlePotencia (R7.1), CPU (U4.70)
PWR_AMP: amplificadorAudio (R82.2), CPU (U4.26)
REED_DOSADOR: CPU (U4.88), EntradaSensores (C19.2 D6.2 R14.2)
RESET: CPU (U4.17), JTAG (6 pins)
ROT_VENTILADOR: CPU (U4.7), EntradaSensores (C21.2 D7.2 R16.2)
RST_WDT: CPU (U4.50), JTAG (U7.4)
RTCK: CPU (U4.100), JTAG (J12.11 J14.2)
RXD_MOEDEIRO: CPU (U4.99), InterfacePagamentos (R76.2)
RXD_PROG: CPU (R38.1 U4.47), InterfaceConfiguracao (U6.12)
SAIDA_01: CPU (U4.95), SaidasMotoresCC (R63.1 R65.1)
SAIDA_02: CPU (U4.94), SaidasMotoresCC (R67.1 R69.1)
SAIDA_03: CPU (U4.93), SaidasMotoresCC (R71.1 R73.1)
SINCRONISMO_60HZ: ControlePotencia (C49.2 R9.1), CPU (U4.52)
TCK: CPU (U4.5), JTAG (J12.9 R51.1)
TDI: CPU (U4.2), JTAG (J12.5 R46.2)
TDO: CPU (U4.1), JTAG (J12.13 R44.2)
TELEMETRIA_RXD: InterfaceConfiguracao (U6.8), InterfaceGSM (J21.4)
TELEMETRIA_TXD: InterfaceConfiguracao (U6.7), InterfaceGSM (J21.5)
TEMPERATURA: CPU (U4.9), EntradaSensorTemperatura (C32.2 FB1.2)
TMS: CPU (U4.3), JTAG (J12.7 R45.2)
TRSTN: CPU (U4.4), JTAG (J12.3 R47.2)
TXD_MOEDEIRO: CPU (U4.98), InterfacePagamentos (R78.2)
TXD_PROG: CPU (R37.1 U4.46), InterfaceConfiguracao (U6.11)